# Altium project OIS_Anakart.PrjPcb (part 1 of 2)
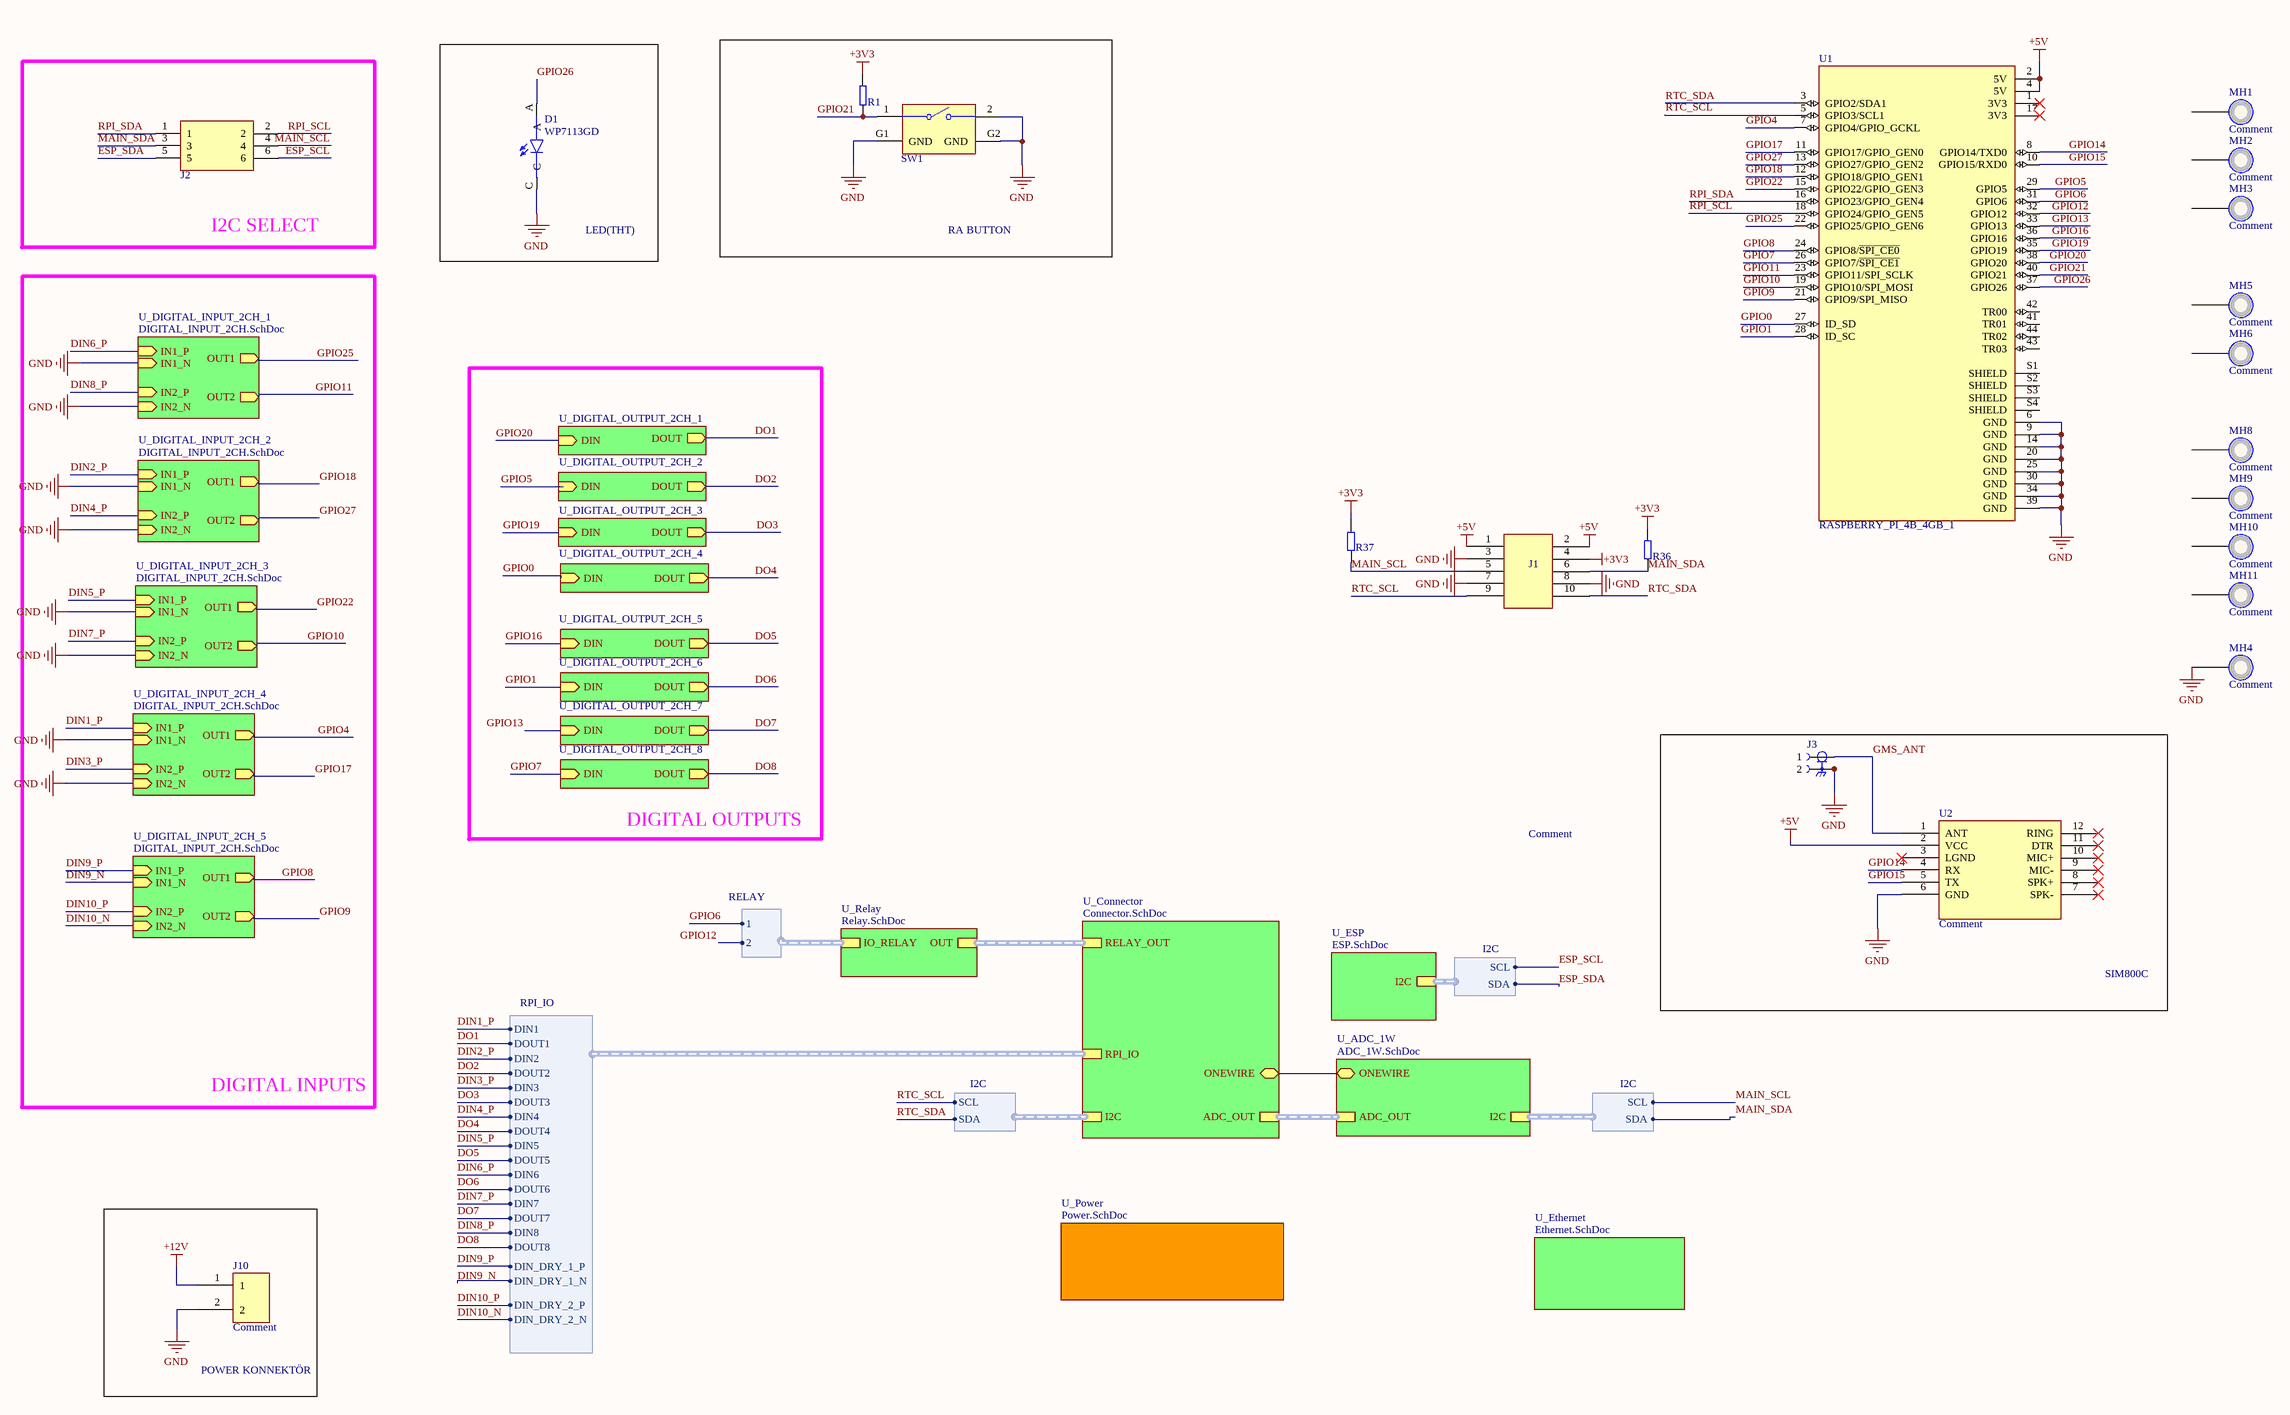
[diagram p0: OIS_Anakart.SchDoc]
10 sheets, 221 parts. Net scope: hierarchical (ports join the sheet entries above them; power ports are global).
Board file: OIS_Anakart.PcbDoc
Sheets:
  OIS_Anakart.SchDoc
    U_DIGITAL_INPUT_2CH_1 = DIGITAL_INPUT_2CH.SchDoc
    U_DIGITAL_OUTPUT_2CH_1 = DIGITAL_OUTPUT_2CH.SchDoc
    U_DIGITAL_OUTPUT_2CH_2 = DIGITAL_OUTPUT_2CH.SchDoc
    U_DIGITAL_OUTPUT_2CH_3 = DIGITAL_OUTPUT_2CH.SchDoc
    U_DIGITAL_OUTPUT_2CH_4 = DIGITAL_OUTPUT_2CH.SchDoc
    U_Relay = Relay.SchDoc
      U_OIS_Relay = OIS_Relay.SchDoc
      U_OIS_Relay = OIS_Relay.SchDoc
    U_Connector = Connector.SchDoc
    U_ESP = ESP.SchDoc
    U_Power = Power.SchDoc
    U_ADC_1W = ADC_1W.SchDoc
    U_DIGITAL_OUTPUT_2CH_5 = DIGITAL_OUTPUT_2CH.SchDoc
    U_DIGITAL_OUTPUT_2CH_6 = DIGITAL_OUTPUT_2CH.SchDoc
    U_DIGITAL_OUTPUT_2CH_7 = DIGITAL_OUTPUT_2CH.SchDoc
    U_DIGITAL_OUTPUT_2CH_8 = DIGITAL_OUTPUT_2CH.SchDoc
    U_DIGITAL_INPUT_2CH_2 = DIGITAL_INPUT_2CH.SchDoc
    U_DIGITAL_INPUT_2CH_3 = DIGITAL_INPUT_2CH.SchDoc
    U_DIGITAL_INPUT_2CH_4 = DIGITAL_INPUT_2CH.SchDoc
    U_DIGITAL_INPUT_2CH_5 = DIGITAL_INPUT_2CH.SchDoc
    U_Ethernet = Ethernet.SchDoc

## Sheet OIS_Anakart.SchDoc
size A2

### Parts
D1  WP7113GD  [LED_WP7113GD]
J1  Comment  [2.54_5x2P]
J2  GRPB032VWQS-RC  [CONN_6P_1.27MM]  (value not drawn)
J3  RF2-49B-T-00-50-G-HDW  [ADAMTECH_RF2-49B-T-00-50-G-HDW]  (value not drawn)
J10  Comment  [691213510002]
MH1  Comment  [m3_3.2x6]  (no BOM)
MH2  Comment  [m3_3.2x6]  (no BOM)
MH3  Comment  [m3_3.2x6]  (no BOM)
MH4  Comment  [m3_3.2x6]  (no BOM)
MH5  Comment  [m3_3.2x6]  (no BOM)
MH6  Comment  [m3_3.2x6]  (no BOM)
MH8  Comment  [m3_3.2x6]  (no BOM)
MH9  Comment  [m3_3.2x6]  (no BOM)
MH10  Comment  [m3_3.2x6]  (no BOM)
MH11  Comment  [m3_3.2x6]  (no BOM)
R1  1K  [R0402]  (value not drawn)
R36  1K  [R0402]  (value not drawn)
R37  1K  [R0402]  (value not drawn)
SW1  431256083716  [4312560837x6]  (value not drawn)
U1  RASPBERRY_PI_4B_4GB_1  [MODULE_RASPBERRY_PI_4B_4GB_2]
U2  Comment  [SIM800C_EVAL]

### Blocks framed on the sheet
I2C SELECT: J2
LED(THT): D1
RA BUTTON: R1 SW1
SIM800C: J3 U2
POWER KONNEKTÖR: J10

### Sub-sheets
U_ADC_1W = ADC_1W.SchDoc: I2C (harness I2C), ADC_OUT (harness ADC_OUT), ONEWIRE (bidir)
U_Connector = Connector.SchDoc: RELAY_OUT (harness RELAY_OUT), ADC_OUT (harness ADC_OUT), ONEWIRE (bidir), I2C (harness I2C), RPI_IO (harness RPI_IO)
U_DIGITAL_INPUT_2CH_1 = DIGITAL_INPUT_2CH.SchDoc: OUT2 (out), OUT1 (out), IN2_N (in), IN2_P (in), IN1_N (in), IN1_P (in)
U_DIGITAL_INPUT_2CH_2 = DIGITAL_INPUT_2CH.SchDoc: OUT2 (out), OUT1 (out), IN2_N (in), IN2_P (in), IN1_N (in), IN1_P (in)
U_DIGITAL_INPUT_2CH_3 = DIGITAL_INPUT_2CH.SchDoc: OUT2 (out), OUT1 (out), IN2_N (in), IN2_P (in), IN1_N (in), IN1_P (in)
U_DIGITAL_INPUT_2CH_4 = DIGITAL_INPUT_2CH.SchDoc: OUT2 (out), OUT1 (out), IN2_N (in), IN2_P (in), IN1_N (in), IN1_P (in)
U_DIGITAL_INPUT_2CH_5 = DIGITAL_INPUT_2CH.SchDoc: OUT2 (out), OUT1 (out), IN2_N (in), IN2_P (in), IN1_N (in), IN1_P (in)
U_DIGITAL_OUTPUT_2CH_1 = DIGITAL_OUTPUT_2CH.SchDoc: DIN (in), DOUT (out)
U_DIGITAL_OUTPUT_2CH_2 = DIGITAL_OUTPUT_2CH.SchDoc: DIN (in), DOUT (out)
U_DIGITAL_OUTPUT_2CH_3 = DIGITAL_OUTPUT_2CH.SchDoc: DIN (in), DOUT (out)
U_DIGITAL_OUTPUT_2CH_4 = DIGITAL_OUTPUT_2CH.SchDoc: DIN (in), DOUT (out)
U_DIGITAL_OUTPUT_2CH_5 = DIGITAL_OUTPUT_2CH.SchDoc: DIN (in), DOUT (out)
U_DIGITAL_OUTPUT_2CH_6 = DIGITAL_OUTPUT_2CH.SchDoc: DIN (in), DOUT (out)
U_DIGITAL_OUTPUT_2CH_7 = DIGITAL_OUTPUT_2CH.SchDoc: DIN (in), DOUT (out)
U_DIGITAL_OUTPUT_2CH_8 = DIGITAL_OUTPUT_2CH.SchDoc: DIN (in), DOUT (out)
U_ESP = ESP.SchDoc: I2C (harness I2C)
U_Ethernet = Ethernet.SchDoc: no entries
U_Power = Power.SchDoc: no entries
U_Relay = Relay.SchDoc: IO_RELAY (harness RELAY), OUT (harness RELAY_OUT)

### Harnesses
I2C: SCL, SDA
RPI_IO: DIN1, DOUT1, DIN2, DOUT2, DIN3, DOUT3, DIN4, DOUT4, DIN5, DOUT5, DIN6, DOUT6, DIN7, DOUT7, DIN8, DOUT8, DIN_DRY_1_P, DIN_DRY_1_N, DIN_DRY_2_N, DIN_DRY_2_P
RELAY: 2, 1

### Nets
+3V3: J1.4 R1.1 R36.1 R37.1
+5V: J1.1 J1.2 U1.2(5V) U1.4(5V) U2.2(VCC)
+12V: J10.1
GND: D1.C J1.3 J1.7 J1.8 J3.SH1 J3.SH2 J3.SH3 J3.SH4(2) J10.2 MH4.1 SW1.2 SW1.G1(GND) SW1.G2(GND) U1.6(GND) U1.9(GND) U1.14(GND) U1.20(GND) U1.25(GND) U1.30(GND) U1.34(GND) U1.39(GND) U2.6(GND) ; sheet U_DIGITAL_INPUT_2CH_1/IN2_N, sheet U_DIGITAL_INPUT_2CH_1/IN1_N, sheet U_DIGITAL_INPUT_2CH_2/IN2_N, sheet U_DIGITAL_INPUT_2CH_2/IN1_N, sheet U_DIGITAL_INPUT_2CH_3/IN2_N, sheet U_DIGITAL_INPUT_2CH_3/IN1_N, sheet U_DIGITAL_INPUT_2CH_4/IN2_N, sheet U_DIGITAL_INPUT_2CH_4/IN1_N
DIN1_P: sheet U_DIGITAL_INPUT_2CH_4/IN1_P, sheet U_Connector/RPI_IO.DIN1
DIN2_P: sheet U_DIGITAL_INPUT_2CH_2/IN1_P, sheet U_Connector/RPI_IO.DIN2
DIN3_P: sheet U_DIGITAL_INPUT_2CH_4/IN2_P, sheet U_Connector/RPI_IO.DIN3
DIN4_P: sheet U_DIGITAL_INPUT_2CH_2/IN2_P, sheet U_Connector/RPI_IO.DIN4
DIN5_P: sheet U_DIGITAL_INPUT_2CH_3/IN1_P, sheet U_Connector/RPI_IO.DIN5
DIN6_P: sheet U_DIGITAL_INPUT_2CH_1/IN1_P, sheet U_Connector/RPI_IO.DIN6
DIN7_P: sheet U_DIGITAL_INPUT_2CH_3/IN2_P, sheet U_Connector/RPI_IO.DIN7
DIN8_P: sheet U_DIGITAL_INPUT_2CH_1/IN2_P, sheet U_Connector/RPI_IO.DIN8
DIN9_N: sheet U_DIGITAL_INPUT_2CH_5/IN1_N, sheet U_Connector/RPI_IO.DIN_DRY_1_N
DIN9_P: sheet U_DIGITAL_INPUT_2CH_5/IN1_P, sheet U_Connector/RPI_IO.DIN_DRY_1_P
DIN10_N: sheet U_DIGITAL_INPUT_2CH_5/IN2_N, sheet U_Connector/RPI_IO.DIN_DRY_2_N
DIN10_P: sheet U_DIGITAL_INPUT_2CH_5/IN2_P, sheet U_Connector/RPI_IO.DIN_DRY_2_P
DO1: sheet U_DIGITAL_OUTPUT_2CH_1/DOUT, sheet U_Connector/RPI_IO.DOUT1
DO2: sheet U_DIGITAL_OUTPUT_2CH_2/DOUT, sheet U_Connector/RPI_IO.DOUT2
DO3: sheet U_DIGITAL_OUTPUT_2CH_3/DOUT, sheet U_Connector/RPI_IO.DOUT3
DO4: sheet U_DIGITAL_OUTPUT_2CH_4/DOUT, sheet U_Connector/RPI_IO.DOUT4
DO5: sheet U_DIGITAL_OUTPUT_2CH_5/DOUT, sheet U_Connector/RPI_IO.DOUT5
DO6: sheet U_DIGITAL_OUTPUT_2CH_6/DOUT, sheet U_Connector/RPI_IO.DOUT6
DO7: sheet U_DIGITAL_OUTPUT_2CH_7/DOUT, sheet U_Connector/RPI_IO.DOUT7
DO8: sheet U_DIGITAL_OUTPUT_2CH_8/DOUT, sheet U_Connector/RPI_IO.DOUT8
DS_IO: sheet U_Connector/ONEWIRE, sheet U_ADC_1W/ONEWIRE
ESP_SCL: J2.6 ; sheet U_ESP/I2C.SCL
ESP_SDA: J2.5 ; sheet U_ESP/I2C.SDA
GMS_ANT: J3.1 U2.1(ANT)
GPIO0: U1.27(ID_SD) ; sheet U_DIGITAL_OUTPUT_2CH_4/DIN
GPIO1: U1.28(ID_SC) ; sheet U_DIGITAL_OUTPUT_2CH_6/DIN
GPIO4: U1.7(GPIO4/GPIO_GCKL) ; sheet U_DIGITAL_INPUT_2CH_4/OUT1
GPIO5: U1.29(GPIO5) ; sheet U_DIGITAL_OUTPUT_2CH_2/DIN
GPIO6: U1.31(GPIO6) ; sheet U_Relay/IO_RELAY.1
GPIO7: U1.26(GPIO7/~{SPI_CE1}) ; sheet U_DIGITAL_OUTPUT_2CH_8/DIN
GPIO8: U1.24(GPIO8/~{SPI_CE0}) ; sheet U_DIGITAL_INPUT_2CH_5/OUT1
GPIO9: U1.21(GPIO9/SPI_MISO) ; sheet U_DIGITAL_INPUT_2CH_5/OUT2
GPIO10: U1.19(GPIO10/SPI_MOSI) ; sheet U_DIGITAL_INPUT_2CH_3/OUT2
GPIO11: U1.23(GPIO11/SPI_SCLK) ; sheet U_DIGITAL_INPUT_2CH_1/OUT2
GPIO12: U1.32(GPIO12) ; sheet U_Relay/IO_RELAY.2
GPIO13: U1.33(GPIO13) ; sheet U_DIGITAL_OUTPUT_2CH_7/DIN
GPIO14: U1.8(GPIO14/TXD0) U2.4(RX)
GPIO15: U1.10(GPIO15/RXD0) U2.5(TX)
GPIO16: U1.36(GPIO16) ; sheet U_DIGITAL_OUTPUT_2CH_5/DIN
GPIO17: U1.11(GPIO17/GPIO_GEN0) ; sheet U_DIGITAL_INPUT_2CH_4/OUT2
GPIO18: U1.12(GPIO18/GPIO_GEN1) ; sheet U_DIGITAL_INPUT_2CH_2/OUT1
GPIO19: U1.35(GPIO19) ; sheet U_DIGITAL_OUTPUT_2CH_3/DIN
GPIO20: U1.38(GPIO20) ; sheet U_DIGITAL_OUTPUT_2CH_1/DIN
GPIO21: R1.2 SW1.1 U1.40(GPIO21)
GPIO22: U1.15(GPIO22/GPIO_GEN3) ; sheet U_DIGITAL_INPUT_2CH_3/OUT1
GPIO25: U1.22(GPIO25/GPIO_GEN6) ; sheet U_DIGITAL_INPUT_2CH_1/OUT1
GPIO26: D1.A U1.37(GPIO26)
GPIO27: U1.13(GPIO27/GPIO_GEN2) ; sheet U_DIGITAL_INPUT_2CH_2/OUT2
MAIN_SCL: J1.5 J2.4 R37.2 ; sheet U_ADC_1W/I2C.SCL  [project net ADC_SCL]
MAIN_SDA: J1.6 J2.3 R36.2 ; sheet U_ADC_1W/I2C.SDA  [project net ADC_SDA]
RPI_SCL: J2.2 U1.18(GPIO24/GPIO_GEN5)
RPI_SDA: J2.1 U1.16(GPIO23/GPIO_GEN4)
RTC_SCL: J1.9 U1.5(GPIO3/SCL1) ; sheet U_Connector/I2C.SCL
RTC_SDA: J1.10 U1.3(GPIO2/SDA1) ; sheet U_Connector/I2C.SDA

Not connected (* = marked no-connect by the designer): MH1 1; MH2 1; MH3 1; MH5 1; MH6 1; MH8 1; MH9 1; MH10 1; MH11 1; U1 1(3V3)* 17(3V3)* 41(TR01) 42(TR00) 43(TR03) 44(TR02) S1(SHIELD) S2(SHIELD) S3(SHIELD) S4(SHIELD); U2 3(LGND)* 7(SPK-)* 8(SPK+)* 9(MIC-)* 10(MIC+)* 11(DTR)* 12(RING)*

### Buses and harness runs
harness sheet U_ADC_1W/ADC_OUT = sheet U_Connector/ADC_OUT
harness sheet U_Connector/RELAY_OUT = sheet U_Relay/OUT

### Notes on the sheet
- DIGITAL OUTPUTS
- DIGITAL INPUTS

### Library data of the parts
D1 = WP7113GD: Green 568nm LED Indication THT; MF: Kingbright; Que: 013; Price: None; Availability: Unavailable; Package: Radial Kingbright; SnapEDA_Link: https://www.snapeda.com/parts/WP7113GD/Kingbright/view-part/573477/?ref=snap; MP: WP7113GD; Value: *; Part Number: WP7113GD
J1 = CONN10P_5x2P: Que: 104; Part Number: CONN10P_5x2P
J2 = GRPB032VWQS-RC: CONN HEADER SMD 6POS 1.27MM; Manufacturer: Sullins Connector Solutions; Que: 052; Number of Position: 6; Connector Style: Header,Female Pin; Name: Ahmet Kemal Ayyildiz; Part Number: GRPB032VWQS-RC; Mounting Type: Surface Mount; Contact Finish: Gold; Datasheet: https://s3.amazonaws.com/catalogspreads-pdf/PAGE94-95%20.050%20MALE%20HDR%20ST%20RA%20SMT.pdf; Manufacturer Part Number: GRPB032VWQS-RC; Date: 25-01-2022
J3 = 2057-RF2-49B-T-00-50-G-HDW-ND: RF SMA CONNECTOR; MF: Adam Tech; Que: 177; SnapEDA_Link: https://www.snapeda.com/parts/RF2-49B-T-00-50-G-HDW/Adam+Tech/view-part/?ref=snap; Package: None; Value: *; MP: RF2-49B-T-00-50-G-HDW; Check_prices: https://www.snapeda.com/parts/RF2-49B-T-00-50-G-HDW/Adam+Tech/view-part/?ref=eda; Part Number: 2057-RF2-49B-T-00-50-G-HDW-ND
J10 = 2P_508: 5.08 mm _ 2 pins; Part Number: 2P_508; Que: 153
MH1-MH6 MH8-MH11 = M3_Vida: Que: 022; DesignItemID: Mounting Hole; Created On: 13.02.2020; Created By: Recep Aydin; Category: Miscellaneous; Part Number: M3_Vida
R1 R36 R37 = RT0402BRE071KL: RES SMD 1K OHM 0.1% 1/16W 0402; Manufacturer: Yageo; Que: 015; Name: Recep Aydin; Part Number: RT0402BRE071KL; Tolerance: 0.1%; Resistor Type: Thick Film; Package: 0402; Datasheet: https://www.yageo.com/upload/media/product/productsearch/datasheet/rchip/PYu-RT_1-to-0.01_RoHS_L_12.pdf; Manufacturer Part Number: RT0402BRE071KL
SW1 = 431256083716: THT Tact Switch 6x6 mm Right Angled; Manufacturer: Wurth Elektronik; Match Code: WS-TATU; Circuit: SPST-NO; Operation Force: 160g; Rated Current: 50mA; Rated Voltage: 12VDC; Washable: No; Que: 014; ComponentLink1Description: Website Link; ComponentLink1URL: https://www.we-online.com/redexpert/article/431256083716?ad; ComponentLink2Description: Datasheet Link; ComponentLink2URL: https://www.we-online.com/redexpert/spec/431256083716?ad; Manufacturer Part Number: 431256083716; Category: Tact Switches; Mount: Through Hole; Operating Temperature Max: 85°C; Operating Temperature Min: -40°C; Packaging: Bulk; Length: 6mm; Width: 6mm; Height: 8.35mm; Contact Material: Stainless Steel; Contact Plating: Silver; Terminal Material: Copper Alloy; Terminal Plating: Silver; Part Number: 431256083716
U1 = MODULE_RASPBERRY_PI_4B_4GB THT CONNECTOR: MODULE_RASPBERRY_PI_4B_4GB; MF: Raspberry Pi; MP: RASPBERRY PI 4B/4GB; Que: 040; Price: None; Check_prices: https://www.snapeda.com/parts/RASPBERRY%20PI%204B/4GB/Raspberry+Pi/view-part/?ref=eda; Value: *; Purchase-URL: https://pricing.snapeda.com/search/part/RASPBERRY PI 4B/4GB/?ref=eda; Availability: In Stock; SnapEDA_Link: https://www.snapeda.com/parts/RASPBERRY%20PI%204B/4GB/Raspberry+Pi/view-part/?ref=snap; Package: None; Part Number: MODULE_RASPBERRY_PI_4B_4GB THT CONNECTOR
U2 = SIM800C_EVAL: Que: 042; Part Number: SIM800C_EVAL

## Sheet DIGITAL_INPUT_2CH.SchDoc
size A
Used 5 times, as channels U_DIGITAL_INPUT_2CH_1, U_DIGITAL_INPUT_2CH_2, U_DIGITAL_INPUT_2CH_3, U_DIGITAL_INPUT_2CH_4, U_DIGITAL_INPUT_2CH_5. Parts and nets are listed once, with the designators drawn on the sheet.
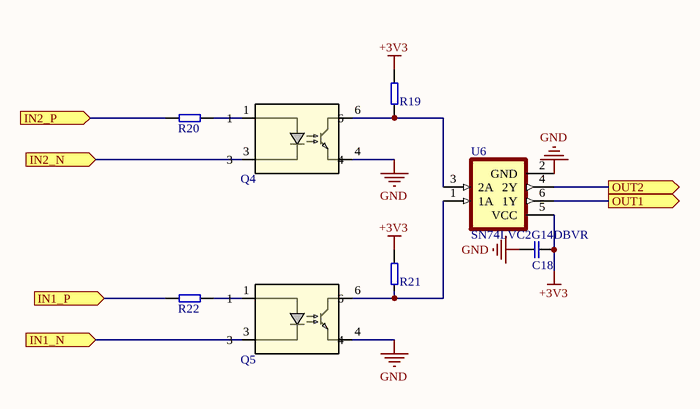
[diagram p1: DIGITAL_INPUT_2CH.SchDoc]

### Parts
C18  0.1uF  [C0402]  (value not drawn)
Q4  TLP188(TPL,E  [OptoCoupler]  (value not drawn)
Q5  TLP188(TPL,E(TPL,E  [OptoCoupler]  (value not drawn)
R19  1K  [R0402]  (value not drawn)
R20  1K  [R0402]  (value not drawn)
R21  1K  [R0402]  (value not drawn)
R22  1K  [R0402]  (value not drawn)
U6  SN74LVC2G14DBVR  [SOT95P280X145-6N]

### Ports
IN1_N (in), IN1_P (in), IN2_N (in), IN2_P (in), OUT1 (out), OUT2 (out)

### Nets
+3V3: C18.2 R19.2 R21.2 U6.5(VCC)
GND: C18.1 Q4.4 Q5.4 U6.2(GND)
IN1_N: Q5.3 ; port IN1_N
IN1_P: R22.2 ; port IN1_P
IN2_N: Q4.3 ; port IN2_N
IN2_P: R20.2 ; port IN2_P
OUT1: U6.6(1Y) ; port OUT1
OUT2: U6.4(2Y) ; port OUT2
NetQ4_1: Q4.1 R20.1
NetQ4_6: Q4.6 R19.1 U6.3(2A)
NetQ5_1: Q5.1 R22.1
NetQ5_6: Q5.6 R21.1 U6.1(1A)

### Channels
U_DIGITAL_INPUT_2CH_1: designators end in _U_DIGITAL_INPUT_2CH_1; ports IN1_N=GND IN1_P=DIN6_P IN2_N=GND IN2_P=DIN8_P OUT1=GPIO25 OUT2=GPIO11
U_DIGITAL_INPUT_2CH_2: designators end in _U_DIGITAL_INPUT_2CH_2; ports IN1_N=GND IN1_P=DIN2_P IN2_N=GND IN2_P=DIN4_P OUT1=GPIO18 OUT2=GPIO27
U_DIGITAL_INPUT_2CH_3: designators end in _U_DIGITAL_INPUT_2CH_3; ports IN1_N=GND IN1_P=DIN5_P IN2_N=GND IN2_P=DIN7_P OUT1=GPIO22 OUT2=GPIO10
U_DIGITAL_INPUT_2CH_4: designators end in _U_DIGITAL_INPUT_2CH_4; ports IN1_N=GND IN1_P=DIN1_P IN2_N=GND IN2_P=DIN3_P OUT1=GPIO4 OUT2=GPIO17
U_DIGITAL_INPUT_2CH_5: designators end in _U_DIGITAL_INPUT_2CH_5; ports IN1_N=DIN9_N IN1_P=DIN9_P IN2_N=DIN10_N IN2_P=DIN10_P OUT1=GPIO8 OUT2=GPIO9

### Library data of the parts
C18 = 04023C104KAT2A: CAP CER 0.1UF 25V X7R 0402; Manufacturer: AVX Corporation; Que: 009; Tolerance: ±10%; Type: Ceramic; Name: Recep Aydin; Part Number: 04023C104KAT2A; Voltage: 25V; Temperature Coefficient: X7R; Package: 0402(1005 Metric); Datasheet: https://datasheets.avx.com/X7RDielectric.pdf; Manufacturer Part Number: 04023C104KAT2A
Q4 Q5 = TLP188(TPL,E: IC-188 OPTOISO 3.75KV TRANS SO6; Mfr_Name: Toshiba Electronic Devices & Storage Corp.; Type: DEV; Number_devices_in_Package: 1; Que: 012; Copyright: Copyright (C) 2023 Ultra Librarian. All rights reserved.; Manufacturer_Part_Number: TLP188(TPL,E; RefDes: RefDes; Source_Package: TLP188; Part Number: TLP188(TPL,E
R19-R22 = RT0402BRE071KL: as R1 on sheet OIS_Anakart; Part Number: RT0402BRE071KL; Tolerance: 0.1%; Resistor Type: Thick Film; Package: 0402; Datasheet: https://www.yageo.com/upload/media/product/productsearch/datasheet/rchip/PYu-RT_1-to-0.01_RoHS_L_12.pdf; Manufacturer Part Number: RT0402BRE071KL
U6 = SN74LVC2G14DBVR: Dual Schmitt-Trigger Inverter 6-SOT-23 -40 to 125; MF: Texas Instruments; Value: *; SnapEDA_Link: https://www.snapeda.com/parts/SN74LVC2G14DBVR/Texas%20Instruments/view-part/77482/?ref=snap; Texas_Instruments-Purchase-URL: https://snapeda.com/shop?store=Texas+Instruments&id=77482; Mouser-Purchase-URL: https://snapeda.com/shop?store=Mouser&id=77482; Price: None; Availability: Unavailable; Package: SOT-23-6 Texas Instruments; DigiKey-Purchase-URL: https://snapeda.com/shop?store=DigiKey&id=77482; MP: SN74LVC2G14DBVR

## Sheet DIGITAL_OUTPUT_2CH.SchDoc
size A4
Used 8 times, as channels U_DIGITAL_OUTPUT_2CH_1, U_DIGITAL_OUTPUT_2CH_2, U_DIGITAL_OUTPUT_2CH_3, U_DIGITAL_OUTPUT_2CH_4, U_DIGITAL_OUTPUT_2CH_5, U_DIGITAL_OUTPUT_2CH_6, U_DIGITAL_OUTPUT_2CH_7, U_DIGITAL_OUTPUT_2CH_8. Parts and nets are listed once, with the designators drawn on the sheet.
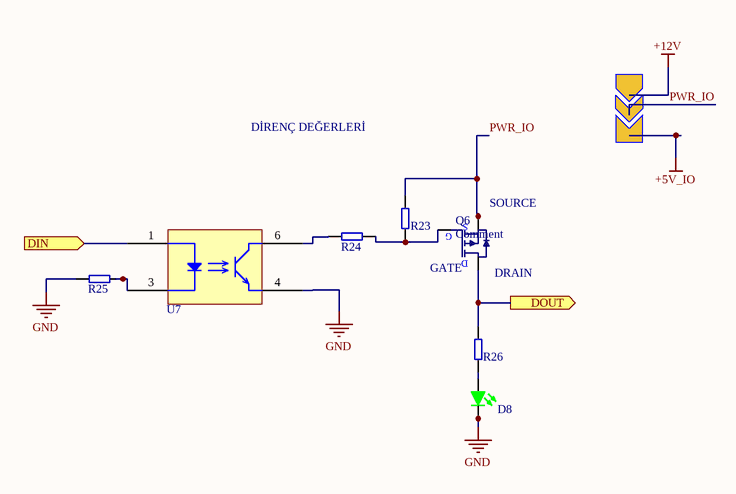
[diagram p2: DIGITAL_OUTPUT_2CH.SchDoc]

### Parts
D8  SML-LX0603GW-TR  [L0603]  (value not drawn)
JMP2  Jumper  [SB0402_3PAD]  (value not drawn)
Q6  Comment  [SOT-23-3]
R23  1K  [R0402]  (value not drawn)
R24  1K  [R0402]  (value not drawn)
R25  1K  [R0402]  (value not drawn)
R26  4.7K  [R0402]  (value not drawn)
U7  TLP183(BLL-TPL,E  [TLP183(BLL-TPL,E]  (value not drawn)

### Ports
DIN (in), DOUT (out)

### Nets
+5V_IO: JMP2.3
+12V: JMP2.1
GND: D8.C R25.1 U7.4(Emi)
DIN: U7.1(A) ; port DIN
DOUT: Q6.3(D) R26.2 ; port DOUT
PWR_IO: JMP2.2 Q6.2(S) R23.1
NetD8_A: D8.A R26.1
NetQ6_1: Q6.1(G) R23.2 R24.2
NetR24_1: R24.1 U7.6(Col)
NetR25_2: R25.2 U7.3(C)

### Channels
U_DIGITAL_OUTPUT_2CH_1: designators end in _U_DIGITAL_OUTPUT_2CH_1; ports DIN=GPIO20 DOUT=DO1
U_DIGITAL_OUTPUT_2CH_2: designators end in _U_DIGITAL_OUTPUT_2CH_2; ports DIN=GPIO5 DOUT=DO2
U_DIGITAL_OUTPUT_2CH_3: designators end in _U_DIGITAL_OUTPUT_2CH_3; ports DIN=GPIO19 DOUT=DO3
U_DIGITAL_OUTPUT_2CH_4: designators end in _U_DIGITAL_OUTPUT_2CH_4; ports DIN=GPIO0 DOUT=DO4
U_DIGITAL_OUTPUT_2CH_5: designators end in _U_DIGITAL_OUTPUT_2CH_5; ports DIN=GPIO16 DOUT=DO5
U_DIGITAL_OUTPUT_2CH_6: designators end in _U_DIGITAL_OUTPUT_2CH_6; ports DIN=GPIO1 DOUT=DO6
U_DIGITAL_OUTPUT_2CH_7: designators end in _U_DIGITAL_OUTPUT_2CH_7; ports DIN=GPIO13 DOUT=DO7
U_DIGITAL_OUTPUT_2CH_8: designators end in _U_DIGITAL_OUTPUT_2CH_8; ports DIN=GPIO7 DOUT=DO8

### Notes on the sheet
- DİRENÇ DEĞERLERİ
- (near Q6) SOURCE
- (near Q6) GATE
- (near Q6) DRAIN

### Library data of the parts
D8 = SML-LX0603GW-TR: LED GREEN DIFFUSED SMD; Manufacturer: Lumex Opto/Components Inc.; Que: 001; Forward Voltage: 2.2V; Current: 20mA; Name: Recep Aydin; Part Number: SML-LX0603GW-TR; LensTransparency: Diffused; Color: Green; Package: 0603(1608 Metric); Datasheet: https://www.lumex.com/datasheet/SML-LX0603GW-TR; Manufacturer Part Number: SML-LX0603GW-TR
JMP2 = Solder Bridge0402_3pad: 0402 Solder Bridge 3 PAD; Que: 008; Name: Recep Aydin; Part Number: Solder Bridge0402_3pad
Q6 = RU20P7C: 20V 5A 28mΩ@4.5V,5A 1.3W 1.1V@250μA P Channel; Que: 009; Part Number: RU20P7C; Type: PMOS; Package: SOT-23-3; Datasheet: https://datasheet.lcsc.com/szlcsc/2008251903_Shenzhen-ruichips-Semicon-RU20P7C_C181984.pdf
R23-R25 = RT0402BRE071KL: as R1 on sheet OIS_Anakart; Part Number: RT0402BRE071KL; Tolerance: 0.1%; Resistor Type: Thick Film; Package: 0402; Datasheet: https://www.yageo.com/upload/media/product/productsearch/datasheet/rchip/PYu-RT_1-to-0.01_RoHS_L_12.pdf; Manufacturer Part Number: RT0402BRE071KL
R26 = CRCW04024K70FKED: RES SMD 4.7K OHM 1% 1/16W 0402; Manufacturer: Vishay Dale; Que: 017; Tolerance: 0.1%; Name: Recep Aydin; Part Number: CRCW04024K70FKED; Resistor Type: Thick Film; Package: 0402; Datasheet: https://www.vishay.com/docs/20035/dcrcwe3.pdf; Manufacturer Part Number: CRCW04024K70FKED
U7 = TLP183(BLL-TPL,E: OPTOISO 3.75KV TRANS 6-SO 4 LEAD; Manufacturer: Toshiba; Que: 003; NumberofChannels: 1; Voltage-Isolation: 3750Vrms; Output Type: Transistor; Output Current: 50mA; Forward Voltage: 1.25V; Name: Recep Aydin; Part Number: TLP183(BLL-TPL,E; Current DC Forward: 50mA; Package: 6-SOIC; Datasheet: https://www.digikey.com/en/products/detail/toshiba-semiconductor-and-storage/TLP183-BLL-TPL-E/4562835; Manufacturer Part Number: TLP183(BLL-TPL,E

## Sheet Relay.SchDoc
size A4
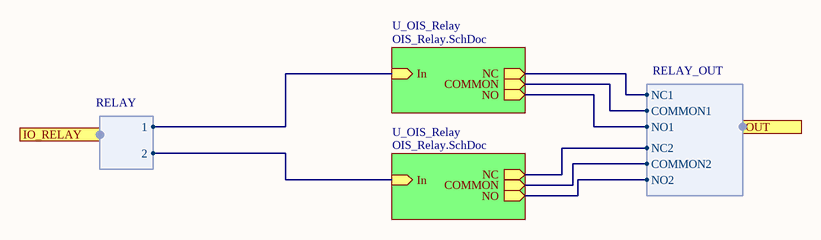
[diagram p3: Relay.SchDoc]

### Sub-sheets
U_OIS_Relay = OIS_Relay.SchDoc: In (in), COMMON (out), NC (out), NO (out)
U_OIS_Relay = OIS_Relay.SchDoc: In (in), COMMON (out), NC (out), NO (out)

### Ports
IO_RELAY (harness RELAY), OUT (harness RELAY_OUT)

### Harnesses
RELAY: 1, 2
RELAY_OUT: COMMON1, NC1, NO1, NC2, COMMON2, NO2

### Nets
COMMON: sheet U_OIS_Relay/COMMON, port OUT.COMMON1
COMMON: sheet U_OIS_Relay/COMMON, port OUT.COMMON2  [a separate net that carries the same name]
GPIO6: sheet U_OIS_Relay/In, port IO_RELAY.1
GPIO12: sheet U_OIS_Relay/In, port IO_RELAY.2
NC: sheet U_OIS_Relay/NC, port OUT.NC1
NC: sheet U_OIS_Relay/NC, port OUT.NC2  [a separate net that carries the same name]
NO: sheet U_OIS_Relay/NO, port OUT.NO1
NO: sheet U_OIS_Relay/NO, port OUT.NO2  [a separate net that carries the same name]

## Sheet OIS_Relay.SchDoc
size A4
Used 2 times, as channels U_Relay/U_OIS_Relay, U_Relay/U_OIS_Relay. Parts and nets are listed once, with the designators drawn on the sheet.
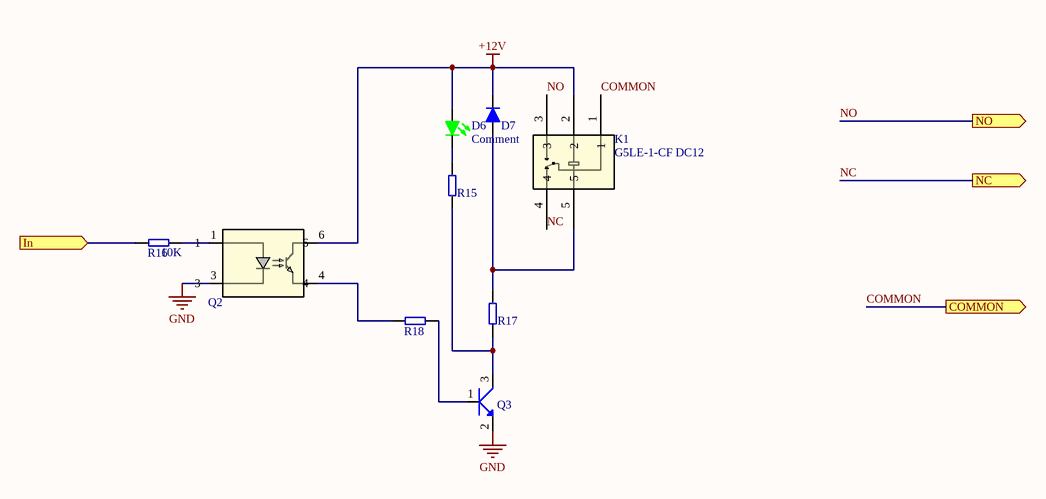
[diagram p4: OIS_Relay.SchDoc]

### Parts
D6  Comment  [L0402_A]
D7  TSSA3U60 R3G  [TAIWAN_TSSA3U60 R3G]  (value not drawn)
K1  G5LE-1-CF DC12  [RELAY_G5LE-1 DC5_OMR]
Q2  TLP188(TPL,E  [OptoCoupler]  (value not drawn)
Q3  MMBT4401-7-F  [SOT-23]  (value not drawn)
R15  1K  [R0402]  (value not drawn)
R16  10K  [R0402]
R17  1K  [R0402]  (value not drawn)
R18  1K  [R0402]  (value not drawn)

### Ports
COMMON (out), In (in), NC (out), NO (out)

### Nets
+12V: D6.A D7.C K1.2 Q2.6
GND: Q2.3 Q3.2(E)
COMMON: K1.1 ; port COMMON
In: R16.1 ; port In
NC: K1.4 ; port NC
NO: K1.3 ; port NO
NetD6_C: D6.C R15.2
NetD7_A: D7.A K1.5 R17.2
NetQ2_1: Q2.1 R16.2
NetQ2_4: Q2.4 R18.1
NetQ3_1: Q3.1(B) R18.2
NetQ3_3: Q3.3(C) R15.1 R17.1

### Channels
U_Relay/U_OIS_Relay: designators end in _U_Relay_U_OIS_Relay#1; ports COMMON=COMMON In=GPIO6 NC=NC NO=NO
U_Relay/U_OIS_Relay: designators end in _U_Relay_U_OIS_Relay#2; ports COMMON=COMMON In=GPIO12 NC=NC NO=NO

### Library data of the parts
D6 = SML-P12VTT86R: LED RED CLEAR 0402 SMD; Que: 005; Forward Voltage: 2V; Current: 20mA; Part Number: SML-P12VTT86R; Color: Red; Package: 0402 (1006 Metric)
D7 = TSSA3U60 R3G: DIODE SCHOTTKY 60V 3A DO214AC; Manufacturer: Taiwan Semiconductor Corporation; Que: 003; Speed: Fast Recovery =< 500ns, > 200mA (Io); Name: Recep Aydin; Part Number: TSSA3U60 R3G; Diode Type: Schottky; Current: 3A; Package: DO-214AC; Datasheet: https://www.taiwansemi.com/assets/uploads/datasheet/TSSA3U60_F1612.pdf; Manufacturer Part Number: TSSA3U60 R3G
K1 = G5LE-1-CF DC12: Mfr_Name: Omron; Que: 038; Copyright: Copyright (C) 2023 Ultra Librarian. All rights reserved.; Manufacturer_Part_Number: G5LE-1-CF DC12; RefDes: RefDes; Type: DEV; Part Number: G5LE-1-CF DC12
Q2 = TLP188(TPL,E: as Q4 on sheet DIGITAL_INPUT_2CH; Copyright: Copyright (C) 2023 Ultra Librarian. All rights reserved.; Manufacturer_Part_Number: TLP188(TPL,E; RefDes: RefDes; Source_Package: TLP188; Part Number: TLP188(TPL,E
Q3 = MMBT4401-7-F: TRANS NPN 40V 0.6A SMD SOT23-3; Manufacturer: Diodes Incorporated; Que: 007; Vce Saturation: 750mV @ 50mA, 500mA; DC Current Gain: 100 @ 150mA, 1V; Frequency: 250Mhz; Name: Recep Aydin; Part Number: MMBT4401-7-F; Type: NPN; Package: SOT-23-3; Datasheet: https://www.diodes.com/assets/Datasheets/ds30039.pdf; Manufacturer Part Number: MMBT4401-7-F
R15 R17 R18 = RT0402BRE071KL: as R1 on sheet OIS_Anakart; Part Number: RT0402BRE071KL; Tolerance: 0.1%; Resistor Type: Thick Film; Package: 0402; Datasheet: https://www.yageo.com/upload/media/product/productsearch/datasheet/rchip/PYu-RT_1-to-0.01_RoHS_L_12.pdf; Manufacturer Part Number: RT0402BRE071KL
R16 = RC1005F103CS: RES SMD 10K OHM 1% 1/16W 0402; Manufacturer: Samsung Electro-Mechanics; Que: 004; Tolerance: 0.1%; Name: Recep Aydin; Part Number: RC1005F103CS; Resistor Type: Thick Film; Package: 0402; Datasheet: https://media.digikey.com/pdf/Data%20Sheets/Samsung%20PDFs/RC_Series_ds.pdf; Manufacturer Part Number: RC1005F103CS

## Sheet Connector.SchDoc
size A3
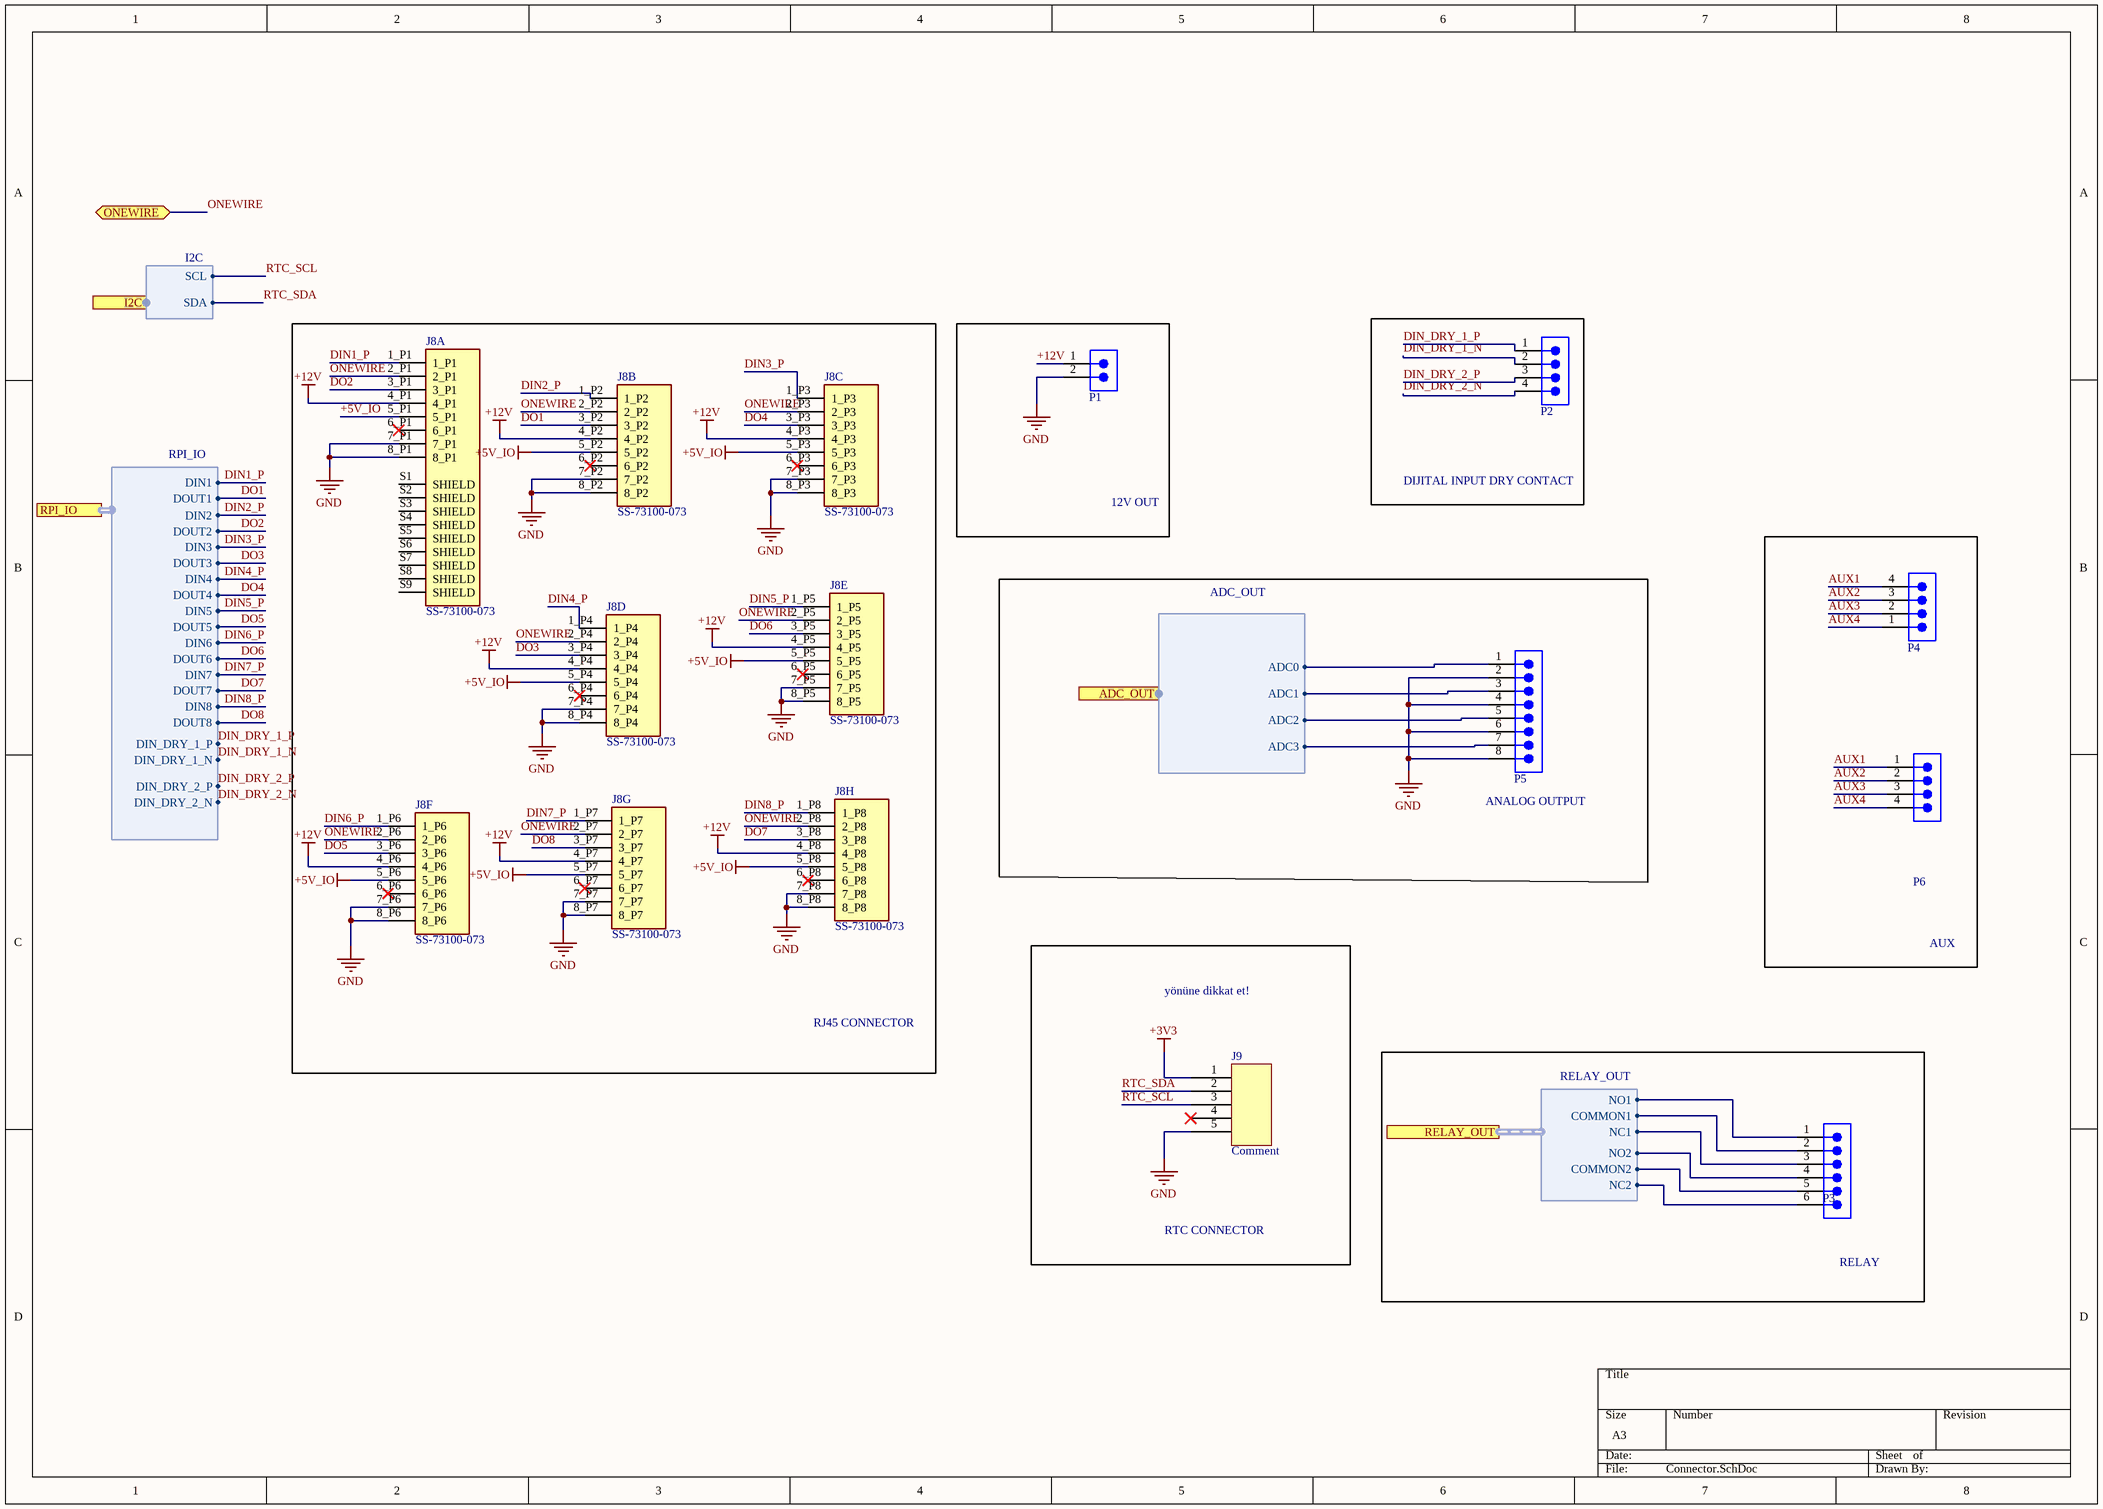
[diagram p5: Connector.SchDoc]

### Parts
J8  SS-73100-073  [BEL_SS-73100-073]  (parts A,B,C,D,E,F,G,H of 8)
J9  Comment  [2.54_5P]
P1  691322310002  [691322310002]  (value not drawn)
P2  691322310004  [691322310004]  (value not drawn)
P3  691305540006  [691305540006]  (value not drawn)
P4  691322310004  [691322310004]  (value not drawn)
P5  691322310008  [691322310008]  (value not drawn)
P6  691322310004  [691322310004]  (value not drawn)

### Blocks framed on the sheet
RJ45 CONNECTOR: J8
12V OUT: P1
DIJITAL INPUT DRY CONTACT: P2
AUX: P4 P6
ANALOG OUTPUT: P5
RELAY: P3

### Ports
ADC_OUT (harness ADC_OUT), I2C (harness I2C), ONEWIRE (bidir), RELAY_OUT (harness RELAY_OUT), RPI_IO (harness RPI_IO)

### Harnesses
ADC_OUT: ADC3, ADC2, ADC1, ADC0
I2C: SCL, SDA
RPI_IO: DIN1, DOUT1, DIN2, DOUT2, DIN3, DOUT3, DIN4, DOUT4, DIN5, DOUT5, DIN6, DOUT6, DIN7, DOUT7, DIN8, DOUT8, DIN_DRY_1_P, DIN_DRY_1_N, DIN_DRY_2_N, DIN_DRY_2_P
RELAY_OUT: COMMON1, NC1, NO1, NC2, COMMON2, NO2

### Nets
+3V3: J9.1
+5V_IO: J8.5_P1 J8.5_P2 J8.5_P3 J8.5_P4 J8.5_P5 J8.5_P6 J8.5_P7 J8.5_P8
+12V: J8.4_P1 J8.4_P2 J8.4_P3 J8.4_P4 J8.4_P5 J8.4_P6 J8.4_P7 J8.4_P8 P1.1
GND: J8.7_P1 J8.7_P2 J8.7_P3 J8.7_P4 J8.7_P5 J8.7_P6 J8.7_P7 J8.7_P8 J8.8_P1 J8.8_P2 J8.8_P3 J8.8_P4 J8.8_P5 J8.8_P6 J8.8_P7 J8.8_P8 J9.5 P1.2 P5.2 P5.4 P5.6 P5.8
ADC0: P5.1 ; port ADC_OUT.ADC0
ADC1: P5.3 ; port ADC_OUT.ADC1
ADC2: P5.5 ; port ADC_OUT.ADC2
ADC3: P5.7 ; port ADC_OUT.ADC3
AUX1: P4.4 P6.1
AUX2: P4.3 P6.2
AUX3: P4.2 P6.3
AUX4: P4.1 P6.4
COMMON: P3.2 ; port RELAY_OUT.COMMON1
COMMON: P3.5 ; port RELAY_OUT.COMMON2  [a separate net that carries the same name]
DIN1_P: J8.1_P1 ; port RPI_IO.DIN1
DIN2_P: J8.1_P2 ; port RPI_IO.DIN2
DIN3_P: J8.1_P3 ; port RPI_IO.DIN3
DIN4_P: J8.1_P4 ; port RPI_IO.DIN4
DIN5_P: J8.1_P5 ; port RPI_IO.DIN5
DIN6_P: J8.1_P6 ; port RPI_IO.DIN6
DIN7_P: J8.1_P7 ; port RPI_IO.DIN7
DIN8_P: J8.1_P8 ; port RPI_IO.DIN8
DIN_DRY_1_N: P2.2 ; port RPI_IO.DIN_DRY_1_N  [project net DIN9_N]
DIN_DRY_1_P: P2.1 ; port RPI_IO.DIN_DRY_1_P  [project net DIN9_P]
DIN_DRY_2_N: P2.4 ; port RPI_IO.DIN_DRY_2_N  [project net DIN10_N]
DIN_DRY_2_P: P2.3 ; port RPI_IO.DIN_DRY_2_P  [project net DIN10_P]
DO1: J8.3_P2 ; port RPI_IO.DOUT1
DO2: J8.3_P1 ; port RPI_IO.DOUT2
DO3: J8.3_P4 ; port RPI_IO.DOUT3
DO4: J8.3_P3 ; port RPI_IO.DOUT4
DO5: J8.3_P6 ; port RPI_IO.DOUT5
DO6: J8.3_P5 ; port RPI_IO.DOUT6
DO7: J8.3_P8 ; port RPI_IO.DOUT7
DO8: J8.3_P7 ; port RPI_IO.DOUT8
NC: P3.3 ; port RELAY_OUT.NC1
NC: P3.6 ; port RELAY_OUT.NC2  [a separate net that carries the same name]
NO: P3.1 ; port RELAY_OUT.NO1
NO: P3.4 ; port RELAY_OUT.NO2  [a separate net that carries the same name]
ONEWIRE: J8.2_P1 J8.2_P2 J8.2_P3 J8.2_P4 J8.2_P5 J8.2_P6 J8.2_P7 J8.2_P8 ; port ONEWIRE  [project net DS_IO]
RTC_SCL: J9.3 ; port I2C.SCL
RTC_SDA: J9.2 ; port I2C.SDA

Not connected (* = marked no-connect by the designer): J8 6_P1* 6_P2* 6_P3* 6_P4* 6_P5* 6_P6* 6_P7* 6_P8* S1(SHIELD) S2(SHIELD) S3(SHIELD) S4(SHIELD) S5(SHIELD) S6(SHIELD) S7(SHIELD) S8(SHIELD) S9(SHIELD); J9 4*

### Notes on the sheet
- yönüne dikkat et!
- RTC CONNECTOR

### Library data of the parts
J8 = SS-73100-073: Jack Modular Connector RJ45, Ethernet RA; MF: Stewart Connector; Que: 174; SnapEDA_Link: https://www.snapeda.com/parts/SS-73100-073/Stewart%20Connector/view-part/79069/?ref=snap; MP: SS-73100-073; Digi-Key_Part_Number: SS-73100-073F-ND; Package: None; Value: *; Check_prices: https://www.snapeda.com/parts/SS-73100-073/Stewart%20Connector/view-part/79069/?ref=eda; Part Number: SS-73100-073
J9 = 2.54_5P_HDR: Que: 091; Part Number: 2.54_5P_HDR
P1 = 691322310002: WR-TBL Series 322 - 3.81 mm Horizontal 2 pin; Manufacturer: Wurth Elektronik; Modularity: No; Pitch: 3.81mm; Rated Current: 10A; Working Voltage: 300V; Que: 170; ComponentLink1Description: Website Link; ComponentLink1URL: https://www.we-online.com/redexpert/article/691322310002?ad; ComponentLink2Description: Datasheet Link; ComponentLink2URL: https://www.we-online.com/redexpert/spec/691322310002?ad; Manufacturer Part Number: 691322310002; Category: Terminal Blocks; Match Code: WR-TBL; Mount: Through Hole; Operating Temperature Max: 105°C; Operating Temperature Min: -40°C; Packaging: Box; Application: Pluggable; Number of Pins: 2; Number of Rows: 1; Orientation: Horizontal; Part Number: 691322310002
P2 P4 P6 = 691322310004: WR-TBL Series 322 - 3.81 mm Horizontal; Manufacturer: Wurth Elektronik; Modularity: No; Pitch: 3.81mm; Rated Current: 10A; Working Voltage: 300V; Que: 169; ComponentLink1Description: Website Link; ComponentLink1URL: https://www.we-online.com/redexpert/article/691322310004?ad; ComponentLink2Description: Datasheet Link; ComponentLink2URL: https://www.we-online.com/redexpert/spec/691322310004?ad; Manufacturer Part Number: 691322310004; Category: Terminal Blocks; Match Code: WR-TBL; Mount: Through Hole; Operating Temperature Max: 105°C; Operating Temperature Min: -40°C; Packaging: Box; Application: Pluggable; Number of Pins: 4; Number of Rows: 1; Orientation: Horizontal; Part Number: 691322310004
P3 = 691305540006: WR-TBL Series 3055 - 5.08 mm 6 pin; Manufacturer: Wurth Elektronik; Modularity: No; Pitch: 5.08mm; Rated Current: 16A; Working Voltage: 300V; Que: 161; ComponentLink1Description: Website Link; ComponentLink1URL: https://www.we-online.com/redexpert/article/691305540006?ad; ComponentLink2Description: Datasheet Link; ComponentLink2URL: https://www.we-online.com/redexpert/spec/691305540006?ad; Manufacturer Part Number: 691305540006; Category: Terminal Blocks; Match Code: WR-TBL; Mount: Through Hole; Operating Temperature Max: 105°C; Operating Temperature Min: -40°C; Packaging: Box; Application: Pluggable; Number of Pins: 6; Number of Rows: 1; Orientation: Horizontal; Part Number: 691305540006
P5 = 691322310008: WR-TBL Series 322 - 3.81 mm Horizontal 8 pin; Manufacturer: Wurth Elektronik; Modularity: No; Pitch: 3.81mm; Rated Current: 10A; Working Voltage: 300V; Que: 172; ComponentLink1Description: Website Link; ComponentLink1URL: https://www.we-online.com/redexpert/article/691322310008?ad; ComponentLink2Description: Datasheet Link; ComponentLink2URL: https://www.we-online.com/redexpert/spec/691322310008?ad; Manufacturer Part Number: 691322310008; Category: Terminal Blocks; Match Code: WR-TBL; Mount: Through Hole; Operating Temperature Max: 105°C; Operating Temperature Min: -40°C; Packaging: Box; Application: Pluggable; Number of Pins: 8; Number of Rows: 1; Orientation: Horizontal; Part Number: 691322310008

## Sheet ESP.SchDoc
size A4
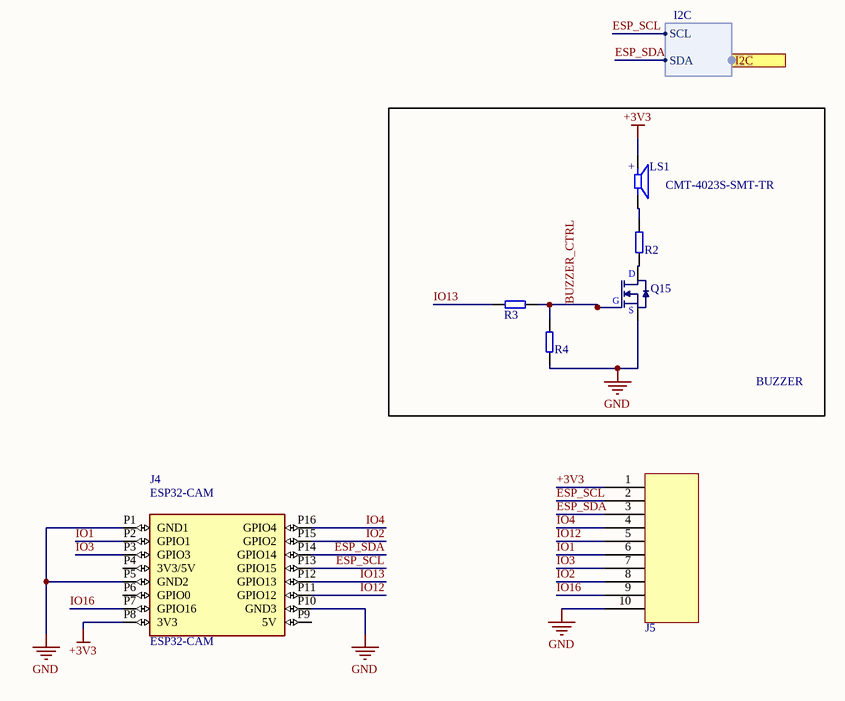
[diagram p6: ESP.SchDoc]

### Parts
J4  ESP32-CAM  [ESP32-CAM]
J5  54202-T0805LF  [10P_2.54MM_SMD]  (value not drawn)
LS1  CMT-4023S-SMT-TR  [Buzzer]
Q15  NTK3043NT1G  [SOT-723]  (value not drawn)
R2  1K  [R0402]  (value not drawn)
R3  1K  [R0402]  (value not drawn)
R4  1K  [R0402]  (value not drawn)

### Blocks framed on the sheet
BUZZER: LS1 Q15 R2-R4

### Ports
I2C (harness I2C)

### Harnesses
I2C: SCL, SDA

### Nets
+3V3: J4.P8(3V3) J5.1 LS1.P
GND: J4.P1(GND1) J4.P5(GND2) J4.P10(GND3) J5.10 Q15.2(S) R4.1
BUZZER_CTRL: Q15.1(G) R3.2 R4.2
ESP_SCL: J4.P13(GPIO15) J5.2 ; port I2C.SCL
ESP_SDA: J4.P14(GPIO14) J5.3 ; port I2C.SDA
IO1: J4.P2(GPIO1) J5.6
IO2: J4.P15(GPIO2) J5.8
IO3: J4.P3(GPIO3) J5.7
IO4: J4.P16(GPIO4) J5.4
IO12: J4.P11(GPIO12) J5.5
IO13: J4.P12(GPIO13) R3.1
IO16: J4.P7(GPIO16) J5.9
NetLS1_N: LS1.N R2.2
NetQ15_3: Q15.3(D) R2.1

Not connected (* = marked no-connect by the designer): J4 P4(3V3/5V) P6(GPIO0) P9(5V)

### Notes on the sheet
- (in symbol CMT-4023S-SMT-TR) +

### Library data of the parts
J4 = ESP32-CAM: CAMERA MODULE; Que: 041; MF: AI-Thinker; Part Number: ESP32-CAM; SnapEDA_Link: https://www.snapeda.com/parts/ESP32-CAM/AI-Thinker/view-part/?ref=snap; Package: None; Value: *; MP: ESP32-CAM; Check_prices: https://www.snapeda.com/parts/ESP32-CAM/AI-Thinker/view-part/?ref=eda
J5 = 54202-T0805LF: CONN HEADER SMD 10POS 2.54MM; Manufacturer: Amphenol ICC (FCI); Que: 056; Number of Position: 10; Connector Style: Header,Male Pin; Name: Ahmet Kemal Ayyildiz; Part Number: 54202-T0805LF; Mounting Type: Surface Mount; Contact Finish: Tin; Datasheet: http://portal.fciconnect.com/Comergent//fci/drawing/54202.pdf; Manufacturer Part Number: 54202-T0805LF; Date: 02.02.2022
LS1 = CMT-4023S-SMT-TR: AUDIO MAGNETIC XDCR 2-4V SMD; Manufacturer: CUI; Voltage Rating: 3V; Frequency: 4kHz; Operating Supply Current: 90mA; Supplier 1: Digi-Key; Stock 1: 2591; Pricing 1: 1=2.78, 10=2.3, 25=2.1236, 50=1.9952, 100=1.8717, 500=1.6036, 1000=1.586 (USD); Mount: Surface Mount; Min Operating Temperature: -20°C; Max Operating Temperature: 70°C; Sensing Method: Magnetic; Packaging: Tape and Reel; Termination: Solder; Length: 4mm; Width: 4mm; Lead Free: Lead Free; ComponentLink1URL: https://www.cui.com/product/resource/digikeypdf/cmt-4023s-smt.pdf?src-supplier=Digi-Key; ComponentLink1Description: https://www.cui.com/product/resource/digikeypdf/cmt-4023s-smt.pdf?src-supplier=Digi-Key; ComponentLink2URL: http://www.cui.com/product/resource/digikeypdf/cmt-4023s-smt.pdf?src-supplier=Digi-Key; ComponentLink2Description: http://www.cui.com/product/resource/digikeypdf/cmt-4023s-smt.pdf?src-supplier=Digi-Key; Supplier Part Number 1: 102-3742-1-ND; Manufacturer Part Number: CMT-4023S-SMT-TR
Q15 = NTK3043NT1G: MOSFET N-CH 20V 210MA SOT723; Manufacturer: ON Semiconductor; Que: 009; Voltage: 1.65V, 4.5V; FET Type: N-Channel; Name: Recep Aydin; Part Number: NTK3043NT1G; Technology: MOSFET; Current: 210mA; Package: SOT-723; Datasheet: https://www.onsemi.com/pdf/datasheet/ntk3043n-d.pdf; Manufacturer Part Number: NTK3043NT1G
R2-R4 = RT0402BRE071KL: as R1 on sheet OIS_Anakart; Part Number: RT0402BRE071KL; Tolerance: 0.1%; Resistor Type: Thick Film; Package: 0402; Datasheet: https://www.yageo.com/upload/media/product/productsearch/datasheet/rchip/PYu-RT_1-to-0.01_RoHS_L_12.pdf; Manufacturer Part Number: RT0402BRE071KL

## Sheet Power.SchDoc
size A4
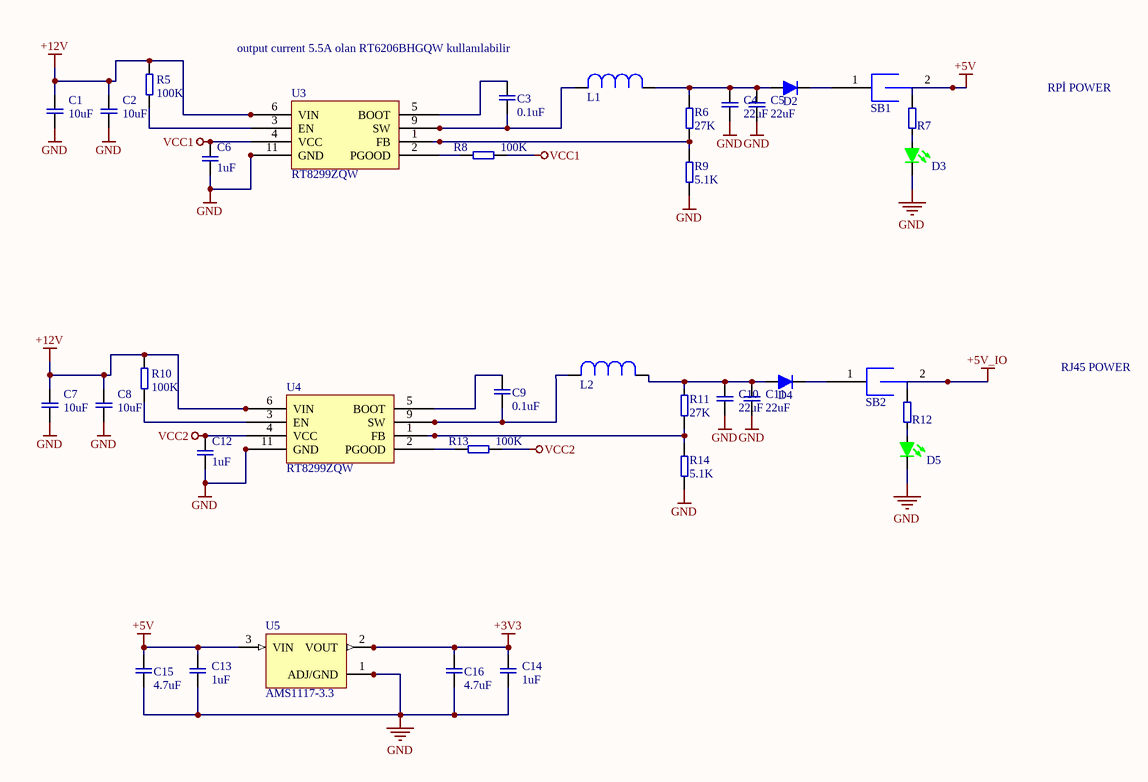
[diagram p7: Power.SchDoc]

### Parts
C1  10uF  [C0805]
C2  10uF  [C0805]
C3  0.1uF  [C0402]
C4  22uF  [C1210]
C5  22uF  [C1210]
C6  1uF  [C0603]
C7  10uF  [C0805]
C8  10uF  [C0805]
C9  0.1uF  [C0402]
C10  22uF  [C1210]
C11  22uF  [C1210]
C12  1uF  [C0603]
C13  1uF  [C0402]
C14  1uF  [C0402]
C15  4.7uF  [C0402]
C16  4.7uF  [C0402]
D2  TSSA3U60 R3G  [TAIWAN_TSSA3U60 R3G]  (value not drawn)
D3  SML-LX0603GW-TR  [L0603]  (value not drawn)
D4  TSSA3U60 R3G  [TAIWAN_TSSA3U60 R3G]  (value not drawn)
D5  SML-LX0603GW-TR  [L0603]  (value not drawn)
L1  XAL6060-682MEB  [CC_XAL6060-682MEB]  (value not drawn)
L2  XAL6060-682MEB  [CC_XAL6060-682MEB]  (value not drawn)
R5  100K  [R0402]
R6  27K  [R0402]
R7  330R  [R0603]  (value not drawn)
R8  100K  [R0402]
R9  5.1K  [R0402]
R10  100K  [R0402]
R11  27K  [R0402]
R12  330R  [R0603]  (value not drawn)
R13  100K  [R0402]
R14  5.1K  [R0402]
SB1  Jumper  [SB.0805]  (value not drawn)
SB2  Jumper  [SB.0805]  (value not drawn)
U3  RT8299ZQW  [RT8299ZQW]
U4  RT8299ZQW  [RT8299ZQW]
U5  AMS1117-3.3  [AMS1117-3.3]

### Nets
+3V3: C14.2 C16.2 U5.2(VOUT)
+5V: C13.2 C15.2 R7.2 SB1.2 U5.3(VIN)
+5V_IO: R12.2 SB2.2
+12V: C1.1 C2.1 C7.1 C8.1 R5.2 R10.2 U3.6(VIN) U3.7(VIN) U4.6(VIN) U4.7(VIN)
GND: C1.2 C2.2 C4.1 C5.1 C6.1 C7.2 C8.2 C10.1 C11.1 C12.1 C13.1 C14.1 C15.1 C16.1 D3.C D5.C R9.2 R14.2 U3.10(GND) U3.11(GND) U4.10(GND) U4.11(GND) U5.1(ADJ/GND)
VCC1: C6.2 R8.1 U3.4(VCC)
VCC2: C12.2 R13.1 U4.4(VCC)
NetC3_1: C3.1 L1.2 U3.8(SW) U3.9(SW)
NetC3_2: C3.2 U3.5(BOOT)
NetC4_2: C4.2 C5.2 D2.A L1.1 R6.2
NetC9_1: C9.1 L2.2 U4.8(SW) U4.9(SW)
NetC9_2: C9.2 U4.5(BOOT)
NetC10_2: C10.2 C11.2 D4.A L2.1 R11.2
NetD2_C: D2.C SB1.1
NetD3_A: D3.A R7.1
NetD4_C: D4.C SB2.1
NetD5_A: D5.A R12.1
NetR5_1: R5.1 U3.3(EN)
NetR6_1: R6.1 R9.1 U3.1(FB)
NetR8_2: R8.2 U3.2(PGOOD)
NetR10_1: R10.1 U4.3(EN)
NetR11_1: R11.1 R14.1 U4.1(FB)
NetR13_2: R13.2 U4.2(PGOOD)

### Notes on the sheet
- output current 5.5A olan RT6206BHGQW kullanılabilir
- RPİ POWER
- RJ45 POWER

### Library data of the parts
C1 C2 C7 C8 = CC0805KKX5R8BB106: CAP CER 10UF 25V X5R 0805; Manufacturer: YAGEO; Que: 074; Tolerance: ±10%; Type: Ceramic; Name: Recep Aydin; Part Number: CC0805KKX5R8BB106; Voltage: 25V; Temperature Coefficient: X5R; Package: 0805(2012 Metric); Datasheet: https://www.yageo.com/upload/media/product/productsearch/datasheet/mlcc/UPY-GPHC_X5R_4V-to-50V_26.pdf; Manufacturer Part Number: CC0805KKX5R8BB106
C3 C9 = 04023C104KAT2A: as C18 on sheet DIGITAL_INPUT_2CH; Part Number: 04023C104KAT2A; Voltage: 25V; Temperature Coefficient: X7R; Package: 0402(1005 Metric); Datasheet: https://datasheets.avx.com/X7RDielectric.pdf; Manufacturer Part Number: 04023C104KAT2A
C4 C5 C10 C11 = CL32A226KAJNNWE: CAP CER 22UF 25V X5R 1210; Manufacturer: Samsung Electro-Mechanics; Que: 018; Tolerance: ±10%; Type: Ceramic; Name: Recep Aydin; Part Number: CL32A226KAJNNWE; Voltage: 25V; Temperature Coefficient: X5R; Package: 1210(3225 Metric); Datasheet: https://www.samsungsem.com/kr/support/product-search/mlcc/CL32A226KAJNNWE.jsp; Manufacturer Part Number: CL32A226KAJNNWE
C6 C12 = CGA3E1X7R1E105M080AC: CAP CER 1UF 25V X7R 0603; Manufacturer: TDK Corporation; Que: 017; Tolerance: ±20%; Type: Ceramic; Name: Recep Aydin; Part Number: CGA3E1X7R1E105M080AC; Voltage: 25V; Temperature Coefficient: X7R; Package: 0603(1608 Metric); Datasheet: https://product.tdk.com/en/system/files?file=dam/doc/product/capacitor/ceramic/mlcc/catalog/mlcc_automotive_general_en.pdf; Manufacturer Part Number: CGA3E1X7R1E105M080AC
C13 C14 = CL05A105KO5NNNC: CAP CER 1UF 16V X5R 0402; Manufacturer: Samsung Electro-Mechanics; Que: 077; Tolerance: ±10%; Type: Ceramic; Name: Recep Aydin; Part Number: CL05A105KO5NNNC; Voltage: 16V; Temperature Coefficient: X5R; Package: 0402(1005 Metric); Datasheet: https://media.digikey.com/pdf/Data%20Sheets/Samsung%20PDFs/CL05A105KO5NNNC_Spec_5-2-19.pdf; Manufacturer Part Number: CL05A105KO5NNNC
C15 C16 = C1005X5R1A475K050BC: CAP CER 4.7UF 10V X5R 0402; Manufacturer: TDK Corporation; Que: 021; Tolerance: ±10%; Type: Ceramic; Name: Recep Aydin; Part Number: C1005X5R1A475K050BC; Voltage: 10V; Temperature Coefficient: X5R; Package: 0402(1005 Metric); Datasheet: https://product.tdk.com/en/system/files?file=dam/doc/product/capacitor/ceramic/mlcc/catalog/mlcc_commercial_general_en.pdf; Manufacturer Part Number: C1005X5R1A475K050BC
D2 D4 = TSSA3U60 R3G: as D7 on sheet OIS_Relay; Part Number: TSSA3U60 R3G; Diode Type: Schottky; Current: 3A; Package: DO-214AC; Datasheet: https://www.taiwansemi.com/assets/uploads/datasheet/TSSA3U60_F1612.pdf; Manufacturer Part Number: TSSA3U60 R3G
D3 D5 = SML-LX0603GW-TR: as D8 on sheet DIGITAL_OUTPUT_2CH; Part Number: SML-LX0603GW-TR; LensTransparency: Diffused; Color: Green; Package: 0603(1608 Metric); Datasheet: https://www.lumex.com/datasheet/SML-LX0603GW-TR; Manufacturer Part Number: SML-LX0603GW-TR
L1 L2 = XAL6060-682MEB: 6.8uH 9A 20.8mOhm Inductor; Manufacturer: Coilcraft; Que: 003; Filter Type: Molded; Name: Recep Aydin; Part Number: XAL6060-682MEB; Current Rating: 9 A; DC Resistance: 20.8 mOhm; Package: PINDC; Datasheet: https://www.mouser.com.tr/datasheet/2/597/xal60xx-270658.pdf; Manufacturer Part Number: XAL6060-682MEB
R5 R8 R10 R13 = RC0402FR-07100KL: RES SMD 100K OHM 1% 1/16W 0402; Manufacturer: YAGEO; Que: 055; Name: Recep Aydin; Part Number: RC0402FR-07100KL; Tolerance: 1%; Resistor Type: Thick Film; Package: 0402; Datasheet: https://www.yageo.com/upload/media/product/productsearch/datasheet/rchip/PYu-RC_Group_51_RoHS_L_11.pdf; Manufacturer Part Number: RC0402FR-07100KL
R6 R11 = RMCF0402FT27K0: RES 27K OHM 1% 1/16W 0402; Manufacturer: Stackpole Electronics Inc; Que: 142; Name: Ahmet Kemal Ayyildiz; Part Number: RMCF0402FT27K0; Tolerance: ±1%; Resistor Type: Thick Film; Package: 0402; Datasheet: https://www.seielect.com/catalog/sei-rmcf_rmcp.pdf; Manufacturer Part Number: RMCF0402FT27K0
R7 R12 = RMCF0603FT330R: RES 330 OHM 1% 1/10W 0603; Manufacturer: Stackpole Electronics Inc; Que: 002; Tolerance: 0.1%; Name: Recep Aydin; Part Number: RMCF0603FT330R; Resistor Type: Thick Film; Package: 0603; Datasheet: https://www.seielect.com/catalog/sei-rmcf_rmcp.pdf; Manufacturer Part Number: RMCF0603FT330R
R9 R14 = RC0402FR-075K1L: RES 5.1K OHM 1% 1/16W 0402; Manufacturer: YAGEO; Que: 089; Name: Recep Aydin; Part Number: RC0402FR-075K1L; Tolerance: 1%; Resistor Type: Thick Film; Package: 0402; Datasheet: https://www.yageo.com/upload/media/product/productsearch/datasheet/rchip/PYu-RC_Group_51_RoHS_L_11.pdf; Manufacturer Part Number: RC0402FR-075K1L
SB1 SB2 = Solder Bridge0805: 0805 Solder Bridge; Que: 006; Name: Recep Aydin; Part Number: Solder Bridge0805
U3 U4 = RT8299ZQW: IC REG BUCK ADJUSTABLE 3A 10WDFN; Manufacturer: Richtek USA Inc.; Que: 025; VoltageIN: 3V-24V; VoltageOUT: 0.8V-15V; Name: Ahmet Kemal Ayyildiz; Part Number: RT8299ZQW; Type: Buck; Package: 10-WFDFN Exposed Pad; Datasheet: https://www.richtek.com/assets/product_file/RT8299/DS8299-05.pdf; Manufacturer Part Number: RT8299ZQW
U5 = AMS1117-3.3: IC-1117 V.REG. 1A 3V3 SOT223 SMD AMS; Que: 021; VoltageIN: 4.8V; VoltageOUT: 3.3V; Name: Ahmet Kemal Ayyildiz; Part Number: AMS1117-3.3; Type: Positive Fixed; Package: SOT223; Datasheet: https://cdn.ozdisan.com/ETicaret_Dosya/348307_6210366.pdf; Manufacturer: AMS; Manufacturer Part Number: AMS1117-3.3

## Sheet ADC_1W.SchDoc
size A4
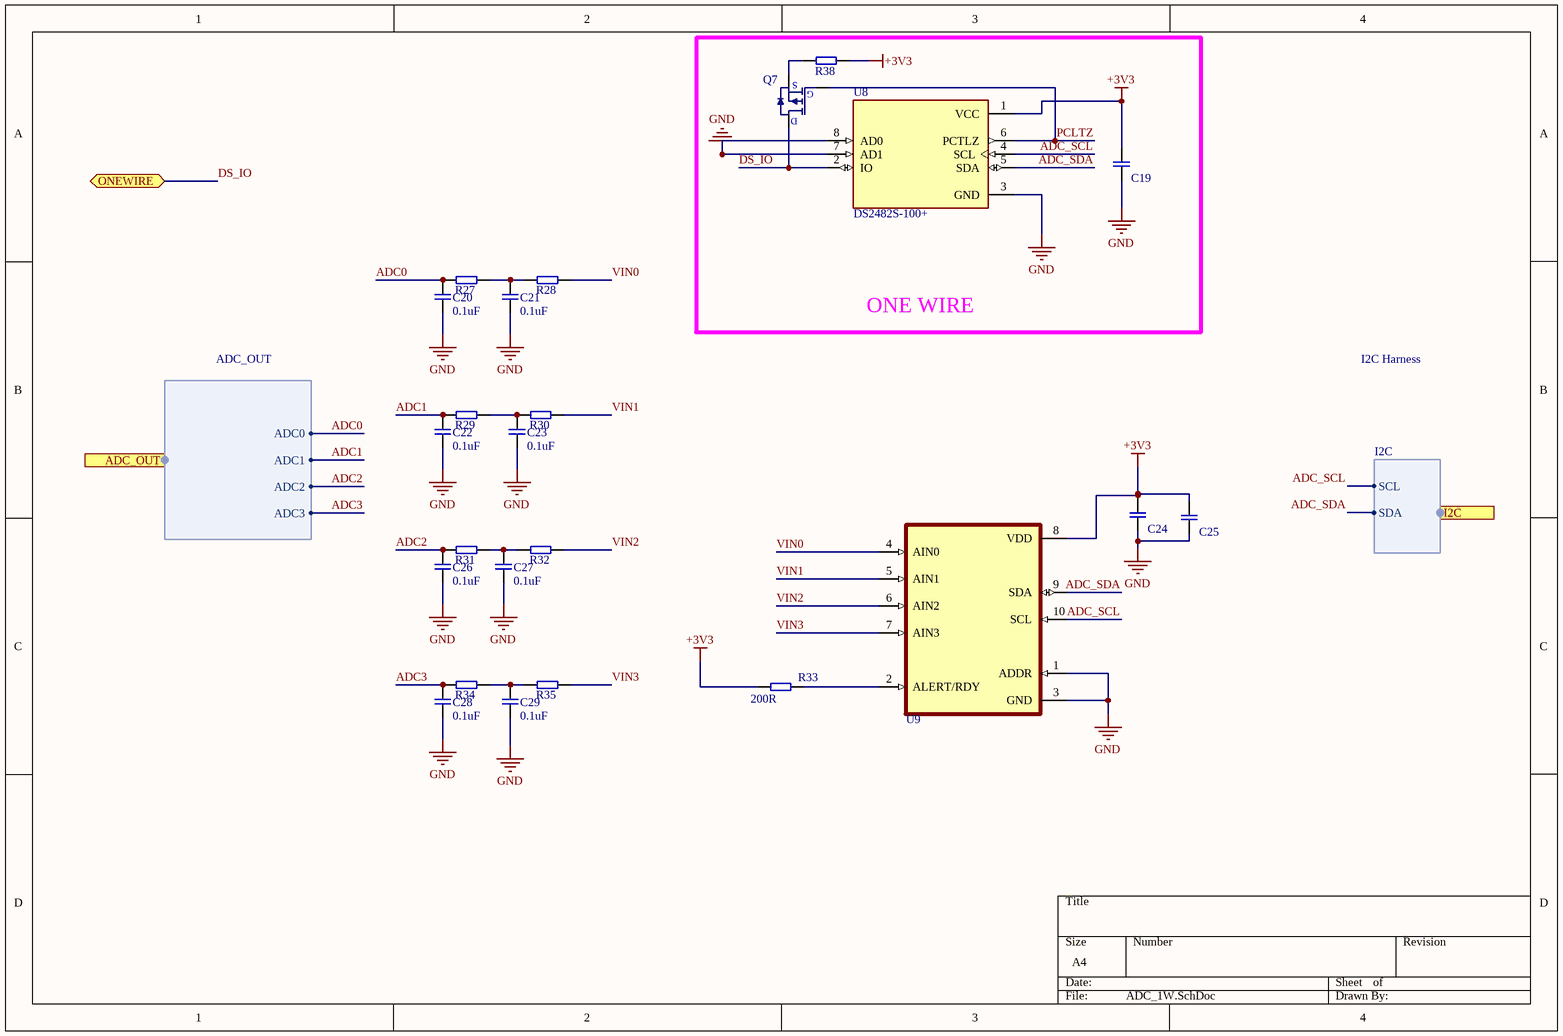
[diagram p8: ADC_1W.SchDoc]

### Parts
C19  1uF  [C0603]  (value not drawn)
C20  0.1uF  [C0402]
C21  0.1uF  [C0402]
C22  0.1uF  [C0402]
C23  0.1uF  [C0402]
C24  1uF  [C0603]  (value not drawn)
C25  10uF  [C0603]  (value not drawn)
C26  0.1uF  [C0402]
C27  0.1uF  [C0402]
C28  0.1uF  [C0402]
C29  0.1uF  [C0402]
Q7  AO3415A  [SOT-23]  (value not drawn)
R27  200R  [R0402]  (value not drawn)
R28  200R  [R0402]  (value not drawn)
R29  200R  [R0402]  (value not drawn)
R30  200R  [R0402]  (value not drawn)
R31  200R  [R0402]  (value not drawn)
R32  200R  [R0402]  (value not drawn)
R33  200R  [R0402]
R34  200R  [R0402]  (value not drawn)
R35  200R  [R0402]  (value not drawn)
R38  1K  [R0402]  (value not drawn)
U8  DS2482S-100+  [SOIC127P600X175-8N]
U9  ADS1115IDGST  [ADS1115IDGST]  (value not drawn)

### Blocks framed on the sheet
ONE WIRE: C19 Q7 R38 U8

### Ports
ADC_OUT (harness ADC_OUT), I2C (harness I2C), ONEWIRE (bidir)

### Harnesses
I2C: SCL, SDA
ADC_OUT: ADC3, ADC2, ADC1, ADC0

### Nets
+3V3: C19.2 C24.2 C25.2 R33.1 R38.1 U8.1(VCC) U9.8(VDD)
GND: C19.1 C20.1 C21.1 C22.1 C23.1 C24.1 C25.1 C26.1 C27.1 C28.1 C29.1 U8.3(GND) U8.7(AD1) U8.8(AD0) U9.1(ADDR) U9.3(GND)
ADC0: C20.2 R27.2 ; port ADC_OUT.ADC0
ADC1: C22.2 R29.2 ; port ADC_OUT.ADC1
ADC2: C26.2 R31.2 ; port ADC_OUT.ADC2
ADC3: C28.2 R34.2 ; port ADC_OUT.ADC3
ADC_SCL: U8.4(SCL) U9.10(SCL) ; port I2C.SCL
ADC_SDA: U8.5(SDA) U9.9(SDA) ; port I2C.SDA
DS_IO: Q7.3(D) U8.2(IO) ; port ONEWIRE
PCLTZ: Q7.1(G) U8.6(PCTLZ)
VIN0: R28.1 U9.4(AIN0)
VIN1: R30.1 U9.5(AIN1)
VIN2: R32.1 U9.6(AIN2)
VIN3: R35.1 U9.7(AIN3)
NetC21_2: C21.2 R27.1 R28.2
NetC23_2: C23.2 R29.1 R30.2
NetC27_2: C27.2 R31.1 R32.2
NetC29_2: C29.2 R34.1 R35.2
NetQ7_2: Q7.2(S) R38.2
NetR33_2: R33.2 U9.2(ALERT/RDY)

### Notes on the sheet
- I2C Harness

### Library data of the parts
C19 C24 = GMC10X5R105K16NT: CAP CER 1UF 16V X5R 0603; Manufacturer: CAL-CHIP ELECTRONICS, INC.; Que: 020; Tolerance: ±10%; Type: Ceramic; Name: Recep Aydin; Part Number: GMC10X5R105K16NT; Voltage: 16V; Temperature Coefficient: X5R; Package: 0603(1608 Metric); Datasheet: http://www.calchipelectronics.com/pdf/gmc_series.pdf; Manufacturer Part Number: GMC10X5R105K16NT
C20-C23 C26-C29 = C1005X5R1A104K050BA: CAP CER 0.1UF 10V X5R 0402; Manufacturer: TDK Corporation; Que: 003; Tolerance: ±10%; Type: Ceramic; Name: Recep Aydin; Part Number: C1005X5R1A104K050BA; Voltage: 10V; Temperature Coefficient: X5R; Package: 0402(1005 Metric); Datasheet: https://product.tdk.com/en/system/files?file=dam/doc/product/capacitor/ceramic/mlcc/catalog/mlcc_commercial_general_en.pdf; Manufacturer Part Number: C1005X5R1A104K050BA
C25 = GRT188R61C106KE13D: CAP CER 10UF 16V X5R 0603; Manufacturer: Murata Electronics; Que: 073; Tolerance: ±10%; Type: Ceramic; Name: Recep Aydin; Part Number: GRT188R61C106KE13D; Voltage: 16V; Temperature Coefficient: X5R; Package: 0603(1608 Metric); Datasheet: https://search.murata.co.jp/Ceramy/image/img/A01X/G101/ENG/GRT188R61C106KE13-01.pdf; Manufacturer Part Number: GRT188R61C106KE13D
Q7 = AO3415A: MOSFET P-CH 20V 5A SOT23-3L; Manufacturer: Alpha & Omega Semiconductor Inc.; Que: 002; Voltage: 1.5V,4.5V; FET Type: P-Channel; Name: Recep Aydin; Part Number: AO3415A; Technology: MOSFET; Current: 5A; Package: SOT-23-3; Datasheet: https://media.digikey.com/pdf/Data%20Sheets/Alpha%20&%20Omega/AO3415A.pdf; Manufacturer Part Number: AO3415A
R27-R35 = 0402WGF2000TCE: RES.(1005) 0402 200 Ohms 1% 1/16W 100PPM; Que: 165; Part Number: 0402WGF2000TCE
R38 = RT0402BRE071KL: as R1 on sheet OIS_Anakart; Part Number: RT0402BRE071KL; Tolerance: 0.1%; Resistor Type: Thick Film; Package: 0402; Datasheet: https://www.yageo.com/upload/media/product/productsearch/datasheet/rchip/PYu-RT_1-to-0.01_RoHS_L_12.pdf; Manufacturer Part Number: RT0402BRE071KL
U8 = DS2482S-100+: IC BRIDGE I2C TO 1-WIRE 8-SOIC; MF: Maxim Integrated; Que: 080; Value: *; Availability: Unavailable; Package: SOIC-8 Maxim; SnapEDA_Link: https://www.snapeda.com/parts/DS2482S-100+/Maxim%20Integrated/view-part/587620/?ref=snap; Price: None; MP: DS2482S-100+; Part Number: DS2482S-100+
U9 = ADS1115IDGST: IC ADC 16BIT SIGMA-DELTA 10VSSOP; Manufacturer: Texas Instruments; Que: 047; Name: İbrahim Akbulut; Package: 10VSSOP; Availability: Unavailable; Value: *; MP: ADS1115IDGST; Price: None; Part Number: ADS1115IDGST; Function: ADC; Datasheet: https://www.digikey.com/en/products/detail/texas-instruments/ADS1115IDGST/2123284; Manufacturer Part Number: ADS1115IDGST

## Sheet Ethernet.SchDoc
size A4
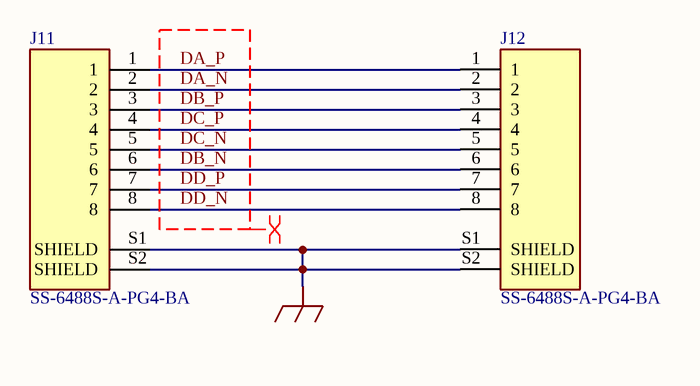
[diagram p9: Ethernet.SchDoc]

### Parts
J11  SS-6488S-A-PG4-BA  [SS-6488S-A-PG4-BA]
J12  SS-6488S-A-PG4-BA  [SS-6488S-A-PG4-BA]

### Nets
FGND: J11.S1(SHIELD) J11.S2(SHIELD) J12.S1(SHIELD) J12.S2(SHIELD)
DA_N: J11.2 J12.2
DA_P: J11.1 J12.1
DB_N: J11.6 J12.6
DB_P: J11.3 J12.3
DC_N: J11.5 J12.5
DC_P: J11.4 J12.4
DD_N: J11.8 J12.8
DD_P: J11.7 J12.7

### Layout directives
differential pair: DA_N, DA_P, DB_N, DB_P, DC_N, DC_P, DD_N, DD_P

### Library data of the parts
J11 J12 = SS-6488S-A-PG4-BA: Jack Modular Connector 8p8c (RJ45, Ethernet) 90Â° Angle (Right) Shielded, EMI Finger; MF: Bel Fuse; Package: None; Availability: Good; Value: *; MP: SS-6488S-A-PG4-BA; DigiKey-Purchase-URL: https://snapeda.com/shop?store=DigiKey&id=700071; Arrow_Europe-Purchase-URL: https://snapeda.com/shop?store=Arrow+Europe&id=700071; SnapEDA_Link: https://www.snapeda.com/parts/SS-6488S-A-PG4-BA/Stewart%20Connector/view-part/700071/?ref=snap; Price: None; Mouser-Purchase-URL: https://snapeda.com/shop?store=Mouser&id=700071; Check_prices: https://www.snapeda.com/parts/SS-6488S-A-PG4-BA/Stewart%20Connector/view-part/700071/?ref=eda